# EAGLE design Decoder (EAGLE 9.6.2)

## Sheet 1 of 5
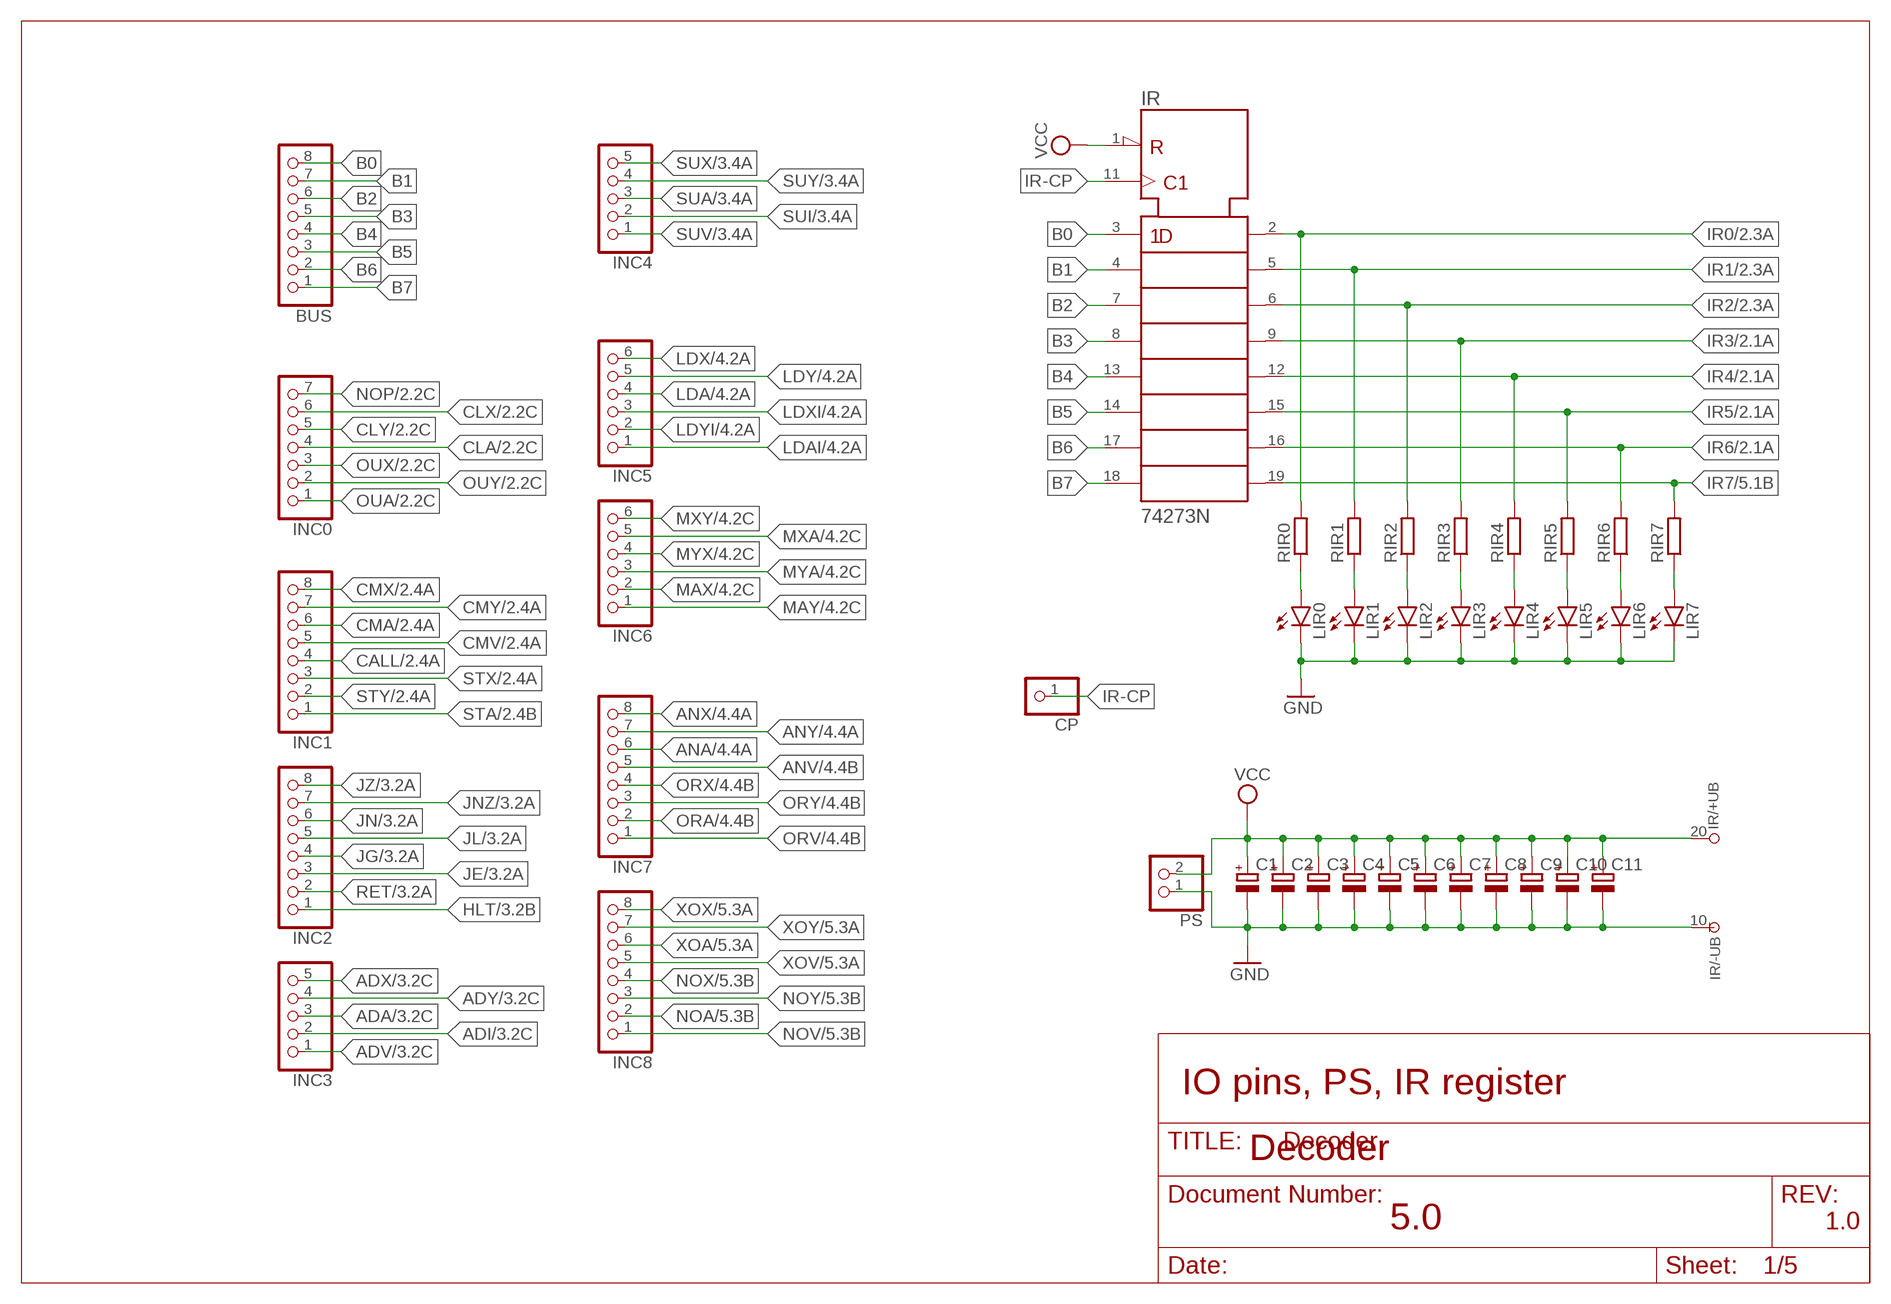
[diagram p0: schematic, sheet 1]

### Parts
BUS  PINHD-1X8  [1X08]
C1  CPOL-EUE2.5-6  [E2,5-6]
C2  CPOL-EUE2.5-6  [E2,5-6]
C3  CPOL-EUE2.5-6  [E2,5-6]
C4  CPOL-EUE2.5-6  [E2,5-6]
C5  CPOL-EUE2.5-6  [E2,5-6]
C6  CPOL-EUE2.5-6  [E2,5-6]
C7  CPOL-EUE2.5-6  [E2,5-6]
C8  CPOL-EUE2.5-6  [E2,5-6]
C9  CPOL-EUE2.5-6  [E2,5-6]
C10  CPOL-EUE2.5-6  [E2,5-6]
C11  CPOL-EUE2.5-6  [E2,5-6]
CP  PINHD-1X1  [1X01]
INC0  PINHD-1X7  [1X07]
INC1  PINHD-1X8  [1X08]
INC2  PINHD-1X8  [1X08]
INC3  PINHD-1X5  [1X05]
INC4  PINHD-1X5  [1X05]
INC5  PINHD-1X6  [1X06]
INC6  PINHD-1X6  [1X06]
INC7  PINHD-1X8  [1X08]
INC8  PINHD-1X8  [1X08]
IR  74273N  [DIL20]
LIR0  LED5MM  [LED5MM]
LIR1  LED5MM  [LED5MM]
LIR2  LED5MM  [LED5MM]
LIR3  LED5MM  [LED5MM]
LIR4  LED5MM  [LED5MM]
LIR5  LED5MM  [LED5MM]
LIR6  LED5MM  [LED5MM]
LIR7  LED5MM  [LED5MM]
PS  PINHD-1X2  [1X02]
RIR0  R-EU_0204/7  [0204/7]
RIR1  R-EU_0204/7  [0204/7]
RIR2  R-EU_0204/7  [0204/7]
RIR3  R-EU_0204/7  [0204/7]
RIR4  R-EU_0204/7  [0204/7]
RIR5  R-EU_0204/7  [0204/7]
RIR6  R-EU_0204/7  [0204/7]
RIR7  R-EU_0204/7  [0204/7]

### Nets
ADA: INC3.3 ; also sheet 3
ADI: INC3.2 ; also sheet 3
ADV: INC3.1 ; also sheet 3
ADX: INC3.5 ; also sheet 3
ADY: INC3.4 ; also sheet 3
ANA: INC7.6 ; also sheet 4
ANV: INC7.5 ; also sheet 4
ANX: INC7.8 ; also sheet 4
ANY: INC7.7 ; also sheet 4
B0: BUS.8 IR.3(1D)
B1: BUS.7 IR.4(2D)
B2: BUS.6 IR.7(3D)
B3: BUS.5 IR.8(4D)
B4: BUS.4 IR.13(5D)
B5: BUS.3 IR.14(6D)
B6: BUS.2 IR.17(7D)
B7: BUS.1 IR.18(8D)
CALL: INC1.4 ; also sheet 2
CLA: INC0.4 ; also sheet 2
CLX: INC0.6 ; also sheet 2
CLY: INC0.5 ; also sheet 2
CMA: INC1.6 ; also sheet 2
CMV: INC1.5 ; also sheet 2
CMX: INC1.8 ; also sheet 2
CMY: INC1.7 ; also sheet 2
GND: C1.- C2.- C3.- C4.- C5.- C6.- C7.- C8.- C9.- C10.- C11.- IR.10(-UB) LIR0.K(C) LIR1.K(C) LIR2.K(C) LIR3.K(C) LIR4.K(C) LIR5.K(C) LIR6.K(C) LIR7.K(C) PS.1 ; also sheet 2,3,4,5
HLT: INC2.1 ; also sheet 3
IR0: IR.2(1Q) RIR0.2 ; also sheet 2,3,4,5
IR1: IR.5(2Q) RIR1.2 ; also sheet 2,3,4,5
IR2: IR.6(3Q) RIR2.2 ; also sheet 2,3,4,5
IR3: IR.9(4Q) RIR3.2 ; also sheet 2
IR4: IR.12(5Q) RIR4.2 ; also sheet 2
IR5: IR.15(6Q) RIR5.2 ; also sheet 2
IR6: IR.16(7Q) RIR6.2 ; also sheet 2
IR7: IR.19(8Q) RIR7.2 ; also sheet 5
IR-CP: CP.1 IR.11(CLK)
JE: INC2.3 ; also sheet 3
JG: INC2.4 ; also sheet 3
JL: INC2.5 ; also sheet 3
JN: INC2.6 ; also sheet 3
JNZ: INC2.7 ; also sheet 3
JZ: INC2.8 ; also sheet 3
LDA: INC5.4 ; also sheet 4
LDAI: INC5.1 ; also sheet 4
LDX: INC5.6 ; also sheet 4
LDXI: INC5.3 ; also sheet 4
LDY: INC5.5 ; also sheet 4
LDYI: INC5.2 ; also sheet 4
MAX: INC6.2 ; also sheet 4
MAY: INC6.1 ; also sheet 4
MXA: INC6.5 ; also sheet 4
MXY: INC6.6 ; also sheet 4
MYA: INC6.3 ; also sheet 4
MYX: INC6.4 ; also sheet 4
N$10: LIR0.A RIR0.1
N$11: LIR1.A RIR1.1
N$12: LIR2.A RIR2.1
N$13: LIR3.A RIR3.1
N$14: LIR4.A RIR4.1
N$15: LIR5.A RIR5.1
N$16: LIR6.A RIR6.1
N$17: LIR7.A RIR7.1
NOA: INC8.2 ; also sheet 5
NOP: INC0.7 ; also sheet 2
NOV: INC8.1 ; also sheet 5
NOX: INC8.4 ; also sheet 5
NOY: INC8.3 ; also sheet 5
ORA: INC7.2 ; also sheet 4
ORV: INC7.1 ; also sheet 4
ORX: INC7.4 ; also sheet 4
ORY: INC7.3 ; also sheet 4
OUA: INC0.1 ; also sheet 2
OUX: INC0.3 ; also sheet 2
OUY: INC0.2 ; also sheet 2
RET: INC2.2 ; also sheet 3
STA: INC1.1 ; also sheet 2
STX: INC1.3 ; also sheet 2
STY: INC1.2 ; also sheet 2
SUA: INC4.3 ; also sheet 3
SUI: INC4.2 ; also sheet 3
SUV: INC4.1 ; also sheet 3
SUX: INC4.5 ; also sheet 3
SUY: INC4.4 ; also sheet 3
VCC: C1.+ C2.+ C3.+ C4.+ C5.+ C6.+ C7.+ C8.+ C9.+ C10.+ C11.+ IR.1(!CLR) IR.20(+UB) PS.2 ; also sheet 2,3,4,5
XOA: INC8.6 ; also sheet 5
XOV: INC8.5 ; also sheet 5
XOX: INC8.8 ; also sheet 5
XOY: INC8.7 ; also sheet 5

### Notes on the sheet
- IO pins, PS, IR register
- Decoder
- 5.0 | 1.0

## Sheet 2 of 5
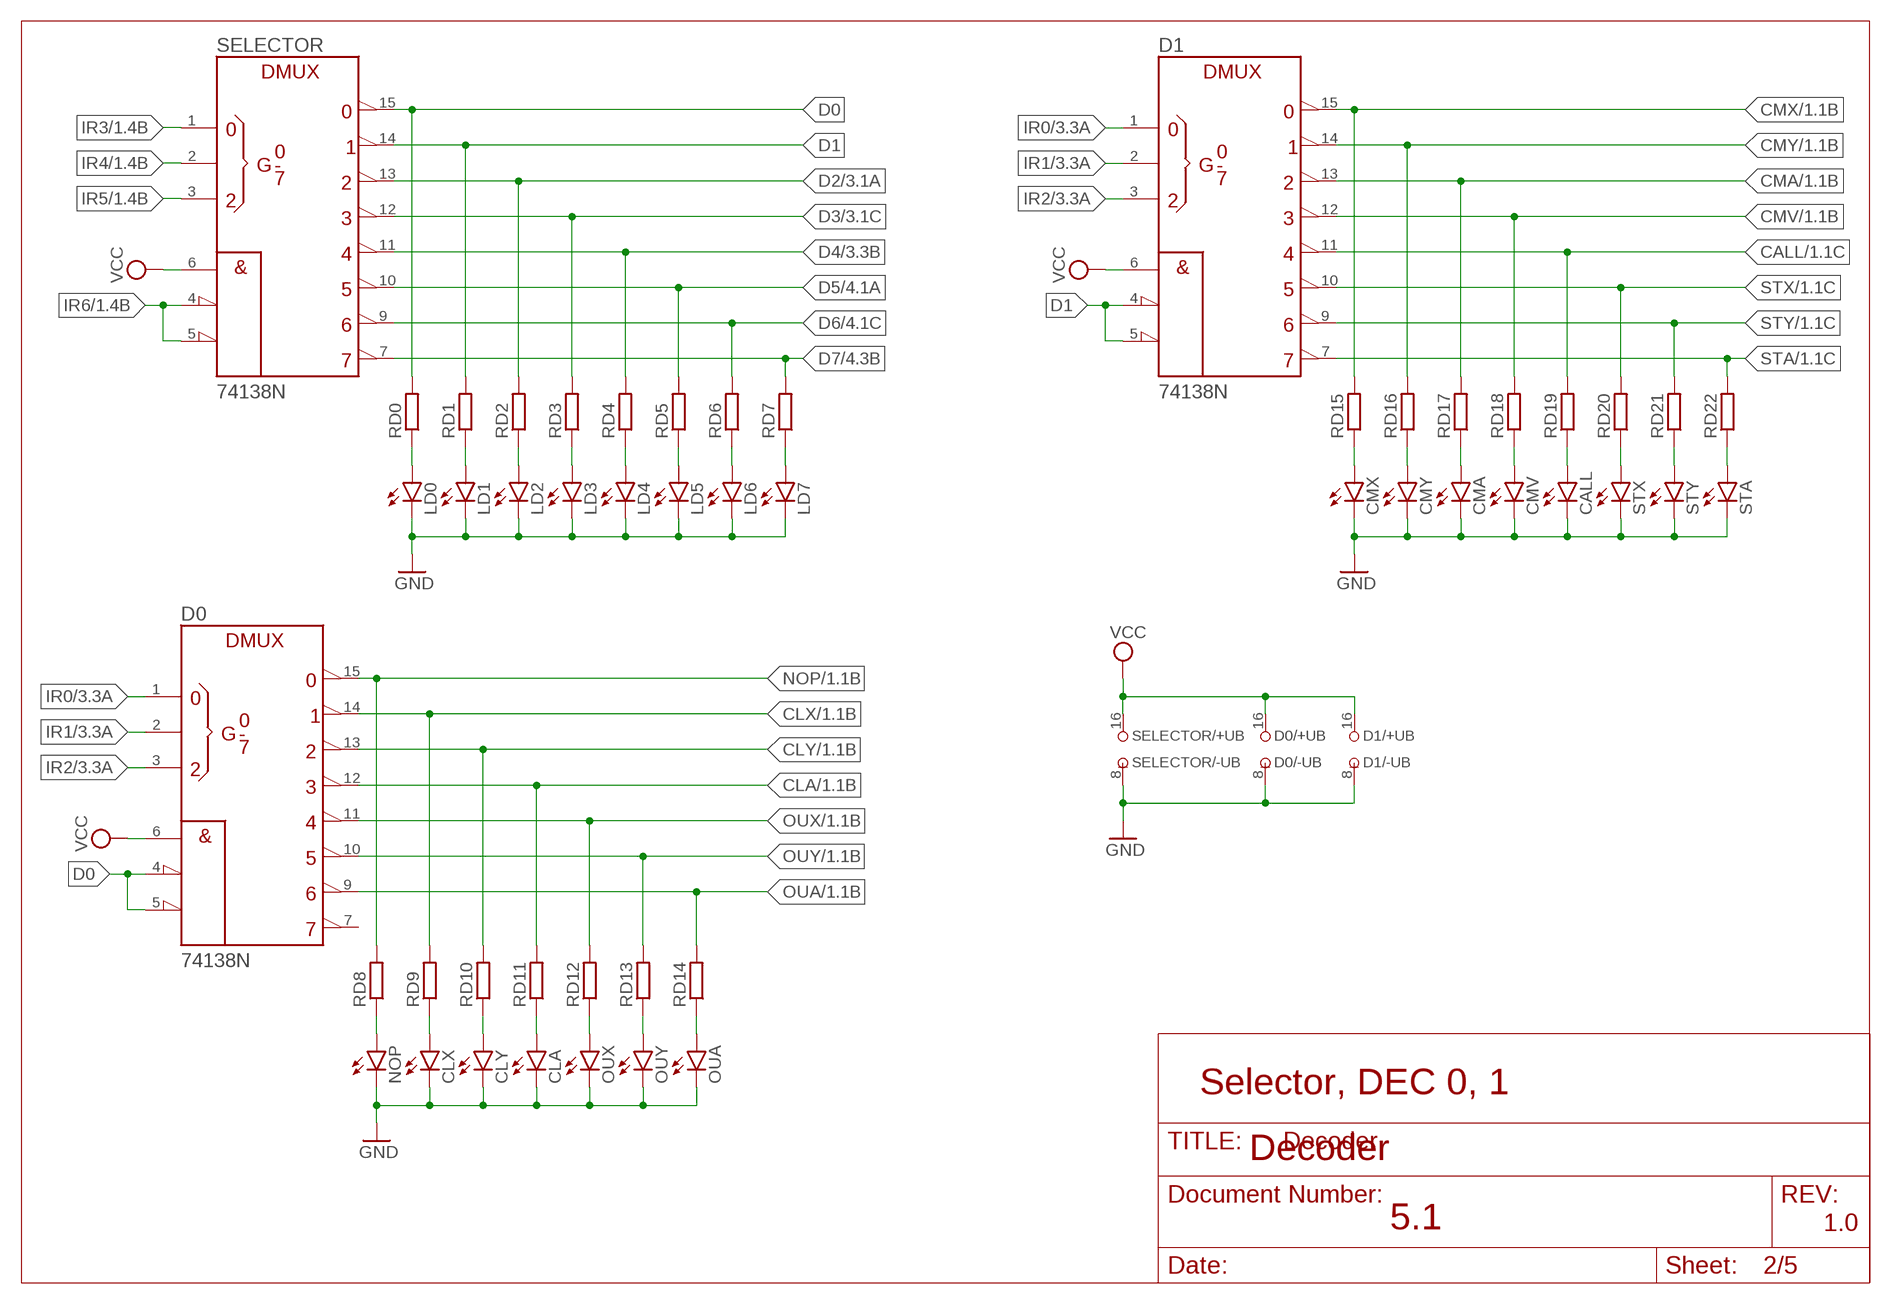
[diagram p1: schematic, sheet 2]

### Parts
CALL  LED5MM  [LED5MM]
CLA  LED5MM  [LED5MM]
CLX  LED5MM  [LED5MM]
CLY  LED5MM  [LED5MM]
CMA  LED5MM  [LED5MM]
CMV  LED5MM  [LED5MM]
CMX  LED5MM  [LED5MM]
CMY  LED5MM  [LED5MM]
D0  74138N  [DIL16]
D1  74138N  [DIL16]
LD0  LED5MM  [LED5MM]
LD1  LED5MM  [LED5MM]
LD2  LED5MM  [LED5MM]
LD3  LED5MM  [LED5MM]
LD4  LED5MM  [LED5MM]
LD5  LED5MM  [LED5MM]
LD6  LED5MM  [LED5MM]
LD7  LED5MM  [LED5MM]
NOP  LED5MM  [LED5MM]
OUA  LED5MM  [LED5MM]
OUX  LED5MM  [LED5MM]
OUY  LED5MM  [LED5MM]
RD0  R-EU_0204/7  [0204/7]
RD1  R-EU_0204/7  [0204/7]
RD2  R-EU_0204/7  [0204/7]
RD3  R-EU_0204/7  [0204/7]
RD4  R-EU_0204/7  [0204/7]
RD5  R-EU_0204/7  [0204/7]
RD6  R-EU_0204/7  [0204/7]
RD7  R-EU_0204/7  [0204/7]
RD8  R-EU_0204/7  [0204/7]
RD9  R-EU_0204/7  [0204/7]
RD10  R-EU_0204/7  [0204/7]
RD11  R-EU_0204/7  [0204/7]
RD12  R-EU_0204/7  [0204/7]
RD13  R-EU_0204/7  [0204/7]
RD14  R-EU_0204/7  [0204/7]
RD15  R-EU_0204/7  [0204/7]
RD16  R-EU_0204/7  [0204/7]
RD17  R-EU_0204/7  [0204/7]
RD18  R-EU_0204/7  [0204/7]
RD19  R-EU_0204/7  [0204/7]
RD20  R-EU_0204/7  [0204/7]
RD21  R-EU_0204/7  [0204/7]
RD22  R-EU_0204/7  [0204/7]
SELECTOR  74138N  [DIL16]
STA  LED5MM  [LED5MM]
STX  LED5MM  [LED5MM]
STY  LED5MM  [LED5MM]

### Nets
CALL: D1.11(Y4) RD19.2 ; also sheet 1
CLA: D0.12(Y3) RD11.2 ; also sheet 1
CLX: D0.14(Y1) RD9.2 ; also sheet 1
CLY: D0.13(Y2) RD10.2 ; also sheet 1
CMA: D1.13(Y2) RD17.2 ; also sheet 1
CMV: D1.12(Y3) RD18.2 ; also sheet 1
CMX: D1.15(Y0) RD15.2 ; also sheet 1
CMY: D1.14(Y1) RD16.2 ; also sheet 1
D0: D0.4(!G2A) D0.5(!G2B) RD0.2 SELECTOR.15(Y0)
D1: D1.4(!G2A) D1.5(!G2B) RD1.2 SELECTOR.14(Y1)
D2: RD2.2 SELECTOR.13(Y2) ; also sheet 3
D3: RD3.2 SELECTOR.12(Y3) ; also sheet 3
D4: RD4.2 SELECTOR.11(Y4) ; also sheet 3
D5: RD5.2 SELECTOR.10(Y5) ; also sheet 4
D6: RD6.2 SELECTOR.9(Y6) ; also sheet 4
D7: RD7.2 SELECTOR.7(Y7) ; also sheet 4
GND: CALL.K(C) CLA.K(C) CLX.K(C) CLY.K(C) CMA.K(C) CMV.K(C) CMX.K(C) CMY.K(C) D0.8(-UB) D1.8(-UB) LD0.K(C) LD1.K(C) LD2.K(C) LD3.K(C) LD4.K(C) LD5.K(C) LD6.K(C) LD7.K(C) NOP.K(C) OUA.K(C) OUX.K(C) OUY.K(C) SELECTOR.8(-UB) STA.K(C) STX.K(C) STY.K(C) ; also sheet 1,3,4,5
IR0: D0.1(A) D1.1(A) ; also sheet 1,3,4,5
IR1: D0.2(B) D1.2(B) ; also sheet 1,3,4,5
IR2: D0.3(C) D1.3(C) ; also sheet 1,3,4,5
IR3: SELECTOR.1(A) ; also sheet 1
IR4: SELECTOR.2(B) ; also sheet 1
IR5: SELECTOR.3(C) ; also sheet 1
IR6: SELECTOR.4(!G2A) SELECTOR.5(!G2B) ; also sheet 1
N$1: LD0.A RD0.1
N$2: LD1.A RD1.1
N$3: LD2.A RD2.1
N$4: LD3.A RD3.1
N$5: LD4.A RD4.1
N$6: LD5.A RD5.1
N$7: LD6.A RD6.1
N$8: LD7.A RD7.1
N$9: CMX.A RD15.1
N$18: CMY.A RD16.1
N$19: CMA.A RD17.1
N$20: CMV.A RD18.1
N$21: CALL.A RD19.1
N$22: RD20.1 STX.A
N$23: RD21.1 STY.A
N$24: RD22.1 STA.A
N$25: NOP.A RD8.1
N$26: CLX.A RD9.1
N$27: CLY.A RD10.1
N$28: CLA.A RD11.1
N$29: OUX.A RD12.1
N$30: OUY.A RD13.1
N$31: OUA.A RD14.1
NOP: D0.15(Y0) RD8.2 ; also sheet 1
OUA: D0.9(Y6) RD14.2 ; also sheet 1
OUX: D0.11(Y4) RD12.2 ; also sheet 1
OUY: D0.10(Y5) RD13.2 ; also sheet 1
STA: D1.7(Y7) RD22.2 ; also sheet 1
STX: D1.10(Y5) RD20.2 ; also sheet 1
STY: D1.9(Y6) RD21.2 ; also sheet 1
VCC: D0.6(G1) D0.16(+UB) D1.6(G1) D1.16(+UB) SELECTOR.6(G1) SELECTOR.16(+UB) ; also sheet 1,3,4,5
Unconnected: D0.7(Y7)

### Notes on the sheet
- Selector, DEC 0, 1
- Decoder
- 5.1 | 1.0

## Sheet 3 of 5
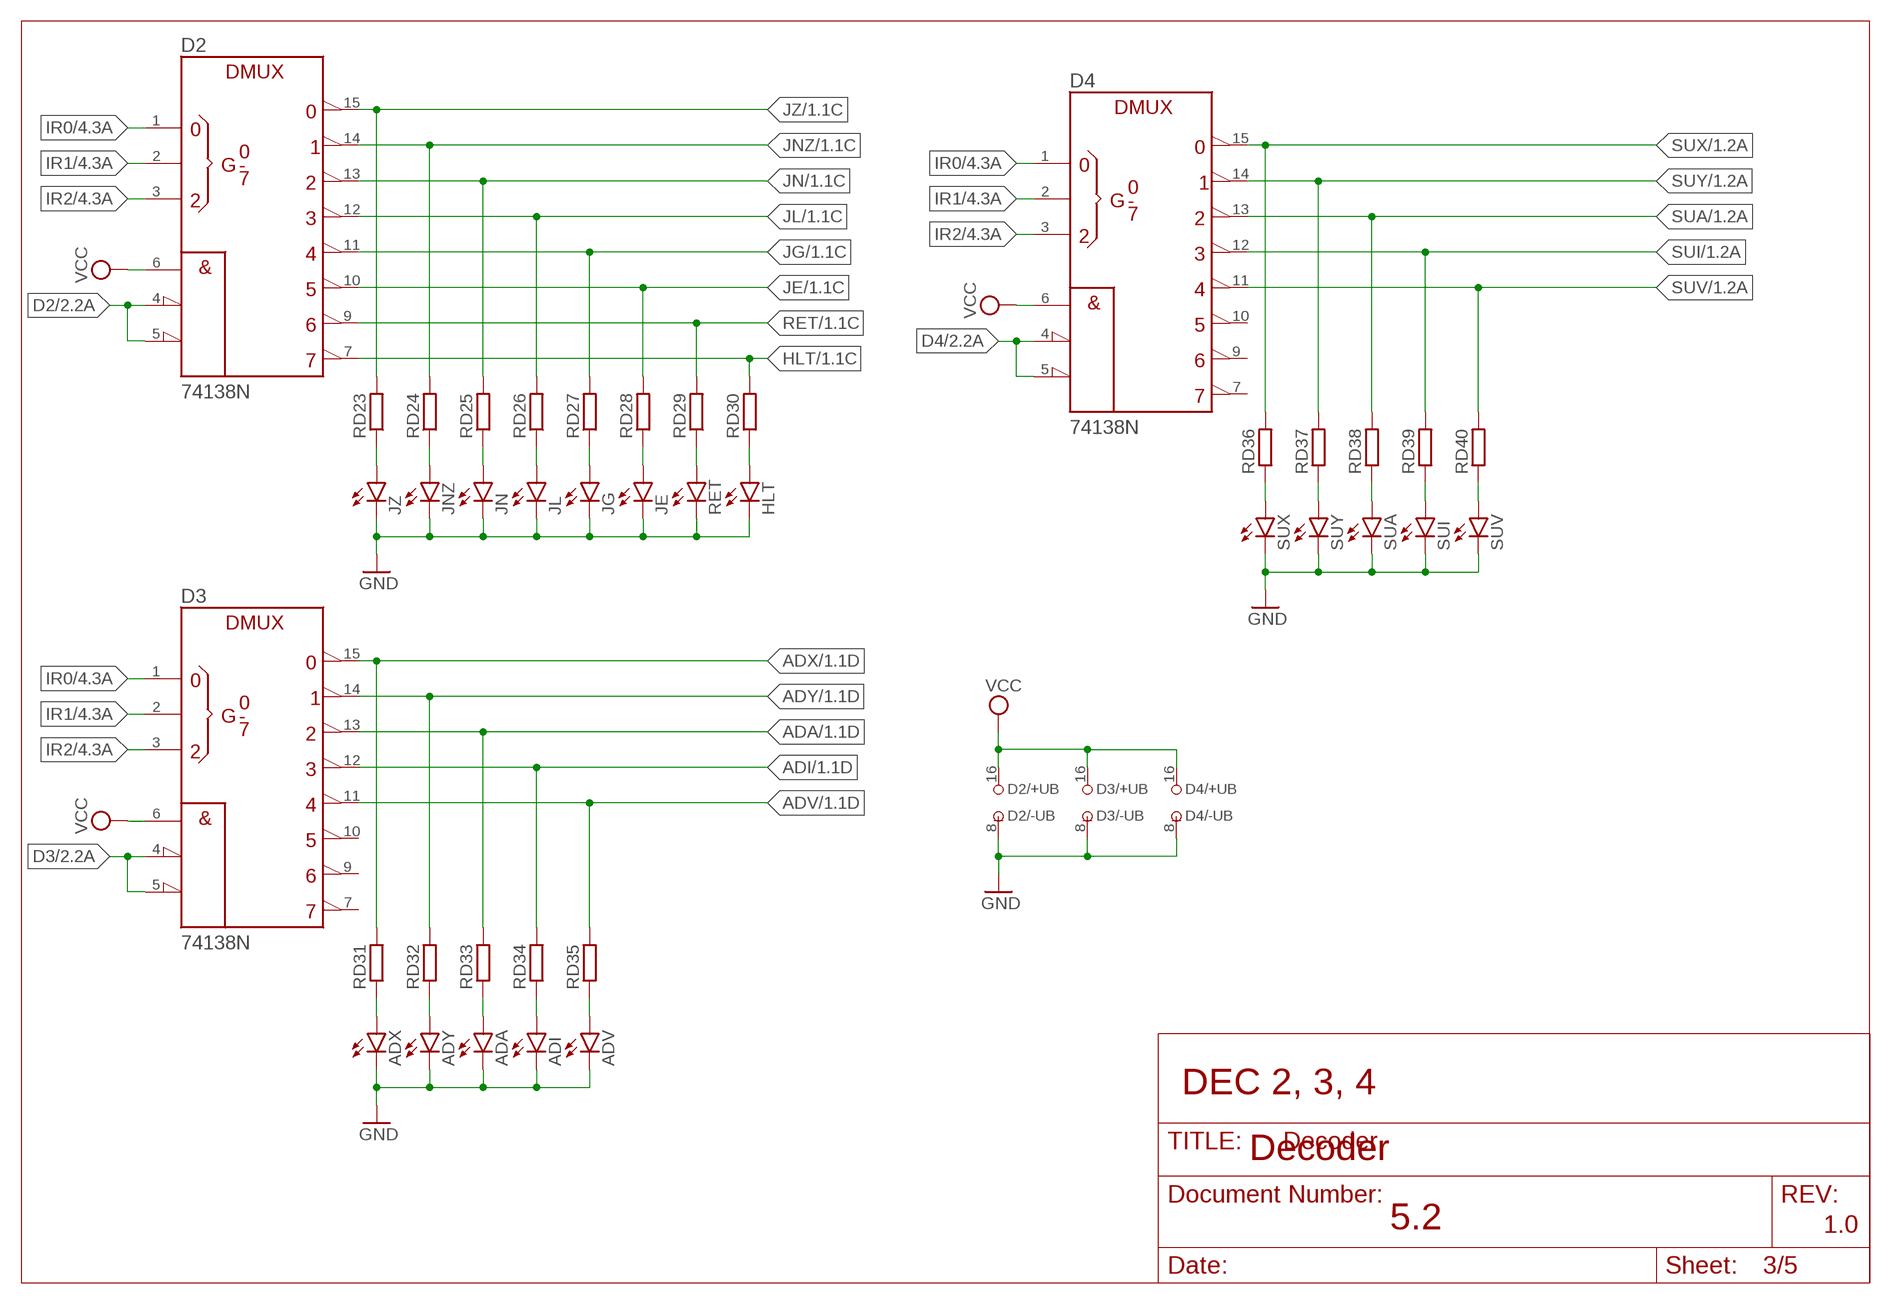
[diagram p2: schematic, sheet 3]

### Parts
ADA  LED5MM  [LED5MM]
ADI  LED5MM  [LED5MM]
ADV  LED5MM  [LED5MM]
ADX  LED5MM  [LED5MM]
ADY  LED5MM  [LED5MM]
D2  74138N  [DIL16]
D3  74138N  [DIL16]
D4  74138N  [DIL16]
HLT  LED5MM  [LED5MM]
JE  LED5MM  [LED5MM]
JG  LED5MM  [LED5MM]
JL  LED5MM  [LED5MM]
JN  LED5MM  [LED5MM]
JNZ  LED5MM  [LED5MM]
JZ  LED5MM  [LED5MM]
RD23  R-EU_0204/7  [0204/7]
RD24  R-EU_0204/7  [0204/7]
RD25  R-EU_0204/7  [0204/7]
RD26  R-EU_0204/7  [0204/7]
RD27  R-EU_0204/7  [0204/7]
RD28  R-EU_0204/7  [0204/7]
RD29  R-EU_0204/7  [0204/7]
RD30  R-EU_0204/7  [0204/7]
RD31  R-EU_0204/7  [0204/7]
RD32  R-EU_0204/7  [0204/7]
RD33  R-EU_0204/7  [0204/7]
RD34  R-EU_0204/7  [0204/7]
RD35  R-EU_0204/7  [0204/7]
RD36  R-EU_0204/7  [0204/7]
RD37  R-EU_0204/7  [0204/7]
RD38  R-EU_0204/7  [0204/7]
RD39  R-EU_0204/7  [0204/7]
RD40  R-EU_0204/7  [0204/7]
RET  LED5MM  [LED5MM]
SUA  LED5MM  [LED5MM]
SUI  LED5MM  [LED5MM]
SUV  LED5MM  [LED5MM]
SUX  LED5MM  [LED5MM]
SUY  LED5MM  [LED5MM]

### Nets
ADA: D3.13(Y2) RD33.2 ; also sheet 1
ADI: D3.12(Y3) RD34.2 ; also sheet 1
ADV: D3.11(Y4) RD35.2 ; also sheet 1
ADX: D3.15(Y0) RD31.2 ; also sheet 1
ADY: D3.14(Y1) RD32.2 ; also sheet 1
D2: D2.4(!G2A) D2.5(!G2B) ; also sheet 2
D3: D3.4(!G2A) D3.5(!G2B) ; also sheet 2
D4: D4.4(!G2A) D4.5(!G2B) ; also sheet 2
GND: ADA.K(C) ADI.K(C) ADV.K(C) ADX.K(C) ADY.K(C) D2.8(-UB) D3.8(-UB) D4.8(-UB) HLT.K(C) JE.K(C) JG.K(C) JL.K(C) JN.K(C) JNZ.K(C) JZ.K(C) RET.K(C) SUA.K(C) SUI.K(C) SUV.K(C) SUX.K(C) SUY.K(C) ; also sheet 1,2,4,5
HLT: D2.7(Y7) RD30.2 ; also sheet 1
IR0: D2.1(A) D3.1(A) D4.1(A) ; also sheet 1,2,4,5
IR1: D2.2(B) D3.2(B) D4.2(B) ; also sheet 1,2,4,5
IR2: D2.3(C) D3.3(C) D4.3(C) ; also sheet 1,2,4,5
JE: D2.10(Y5) RD28.2 ; also sheet 1
JG: D2.11(Y4) RD27.2 ; also sheet 1
JL: D2.12(Y3) RD26.2 ; also sheet 1
JN: D2.13(Y2) RD25.2 ; also sheet 1
JNZ: D2.14(Y1) RD24.2 ; also sheet 1
JZ: D2.15(Y0) RD23.2 ; also sheet 1
N$32: JZ.A RD23.1
N$33: JNZ.A RD24.1
N$34: JN.A RD25.1
N$35: JL.A RD26.1
N$36: JG.A RD27.1
N$37: JE.A RD28.1
N$38: RD29.1 RET.A
N$39: HLT.A RD30.1
N$40: ADX.A RD31.1
N$41: ADY.A RD32.1
N$42: ADA.A RD33.1
N$43: ADI.A RD34.1
N$44: ADV.A RD35.1
N$45: RD36.1 SUX.A
N$46: RD37.1 SUY.A
N$47: RD38.1 SUA.A
N$48: RD39.1 SUI.A
N$49: RD40.1 SUV.A
RET: D2.9(Y6) RD29.2 ; also sheet 1
SUA: D4.13(Y2) RD38.2 ; also sheet 1
SUI: D4.12(Y3) RD39.2 ; also sheet 1
SUV: D4.11(Y4) RD40.2 ; also sheet 1
SUX: D4.15(Y0) RD36.2 ; also sheet 1
SUY: D4.14(Y1) RD37.2 ; also sheet 1
VCC: D2.6(G1) D2.16(+UB) D3.6(G1) D3.16(+UB) D4.6(G1) D4.16(+UB) ; also sheet 1,2,4,5
Unconnected: D3.7(Y7) D3.9(Y6) D3.10(Y5) D4.7(Y7) D4.9(Y6) D4.10(Y5)

### Notes on the sheet
- DEC 2, 3, 4
- Decoder
- 5.2 | 1.0

## Sheet 4 of 5
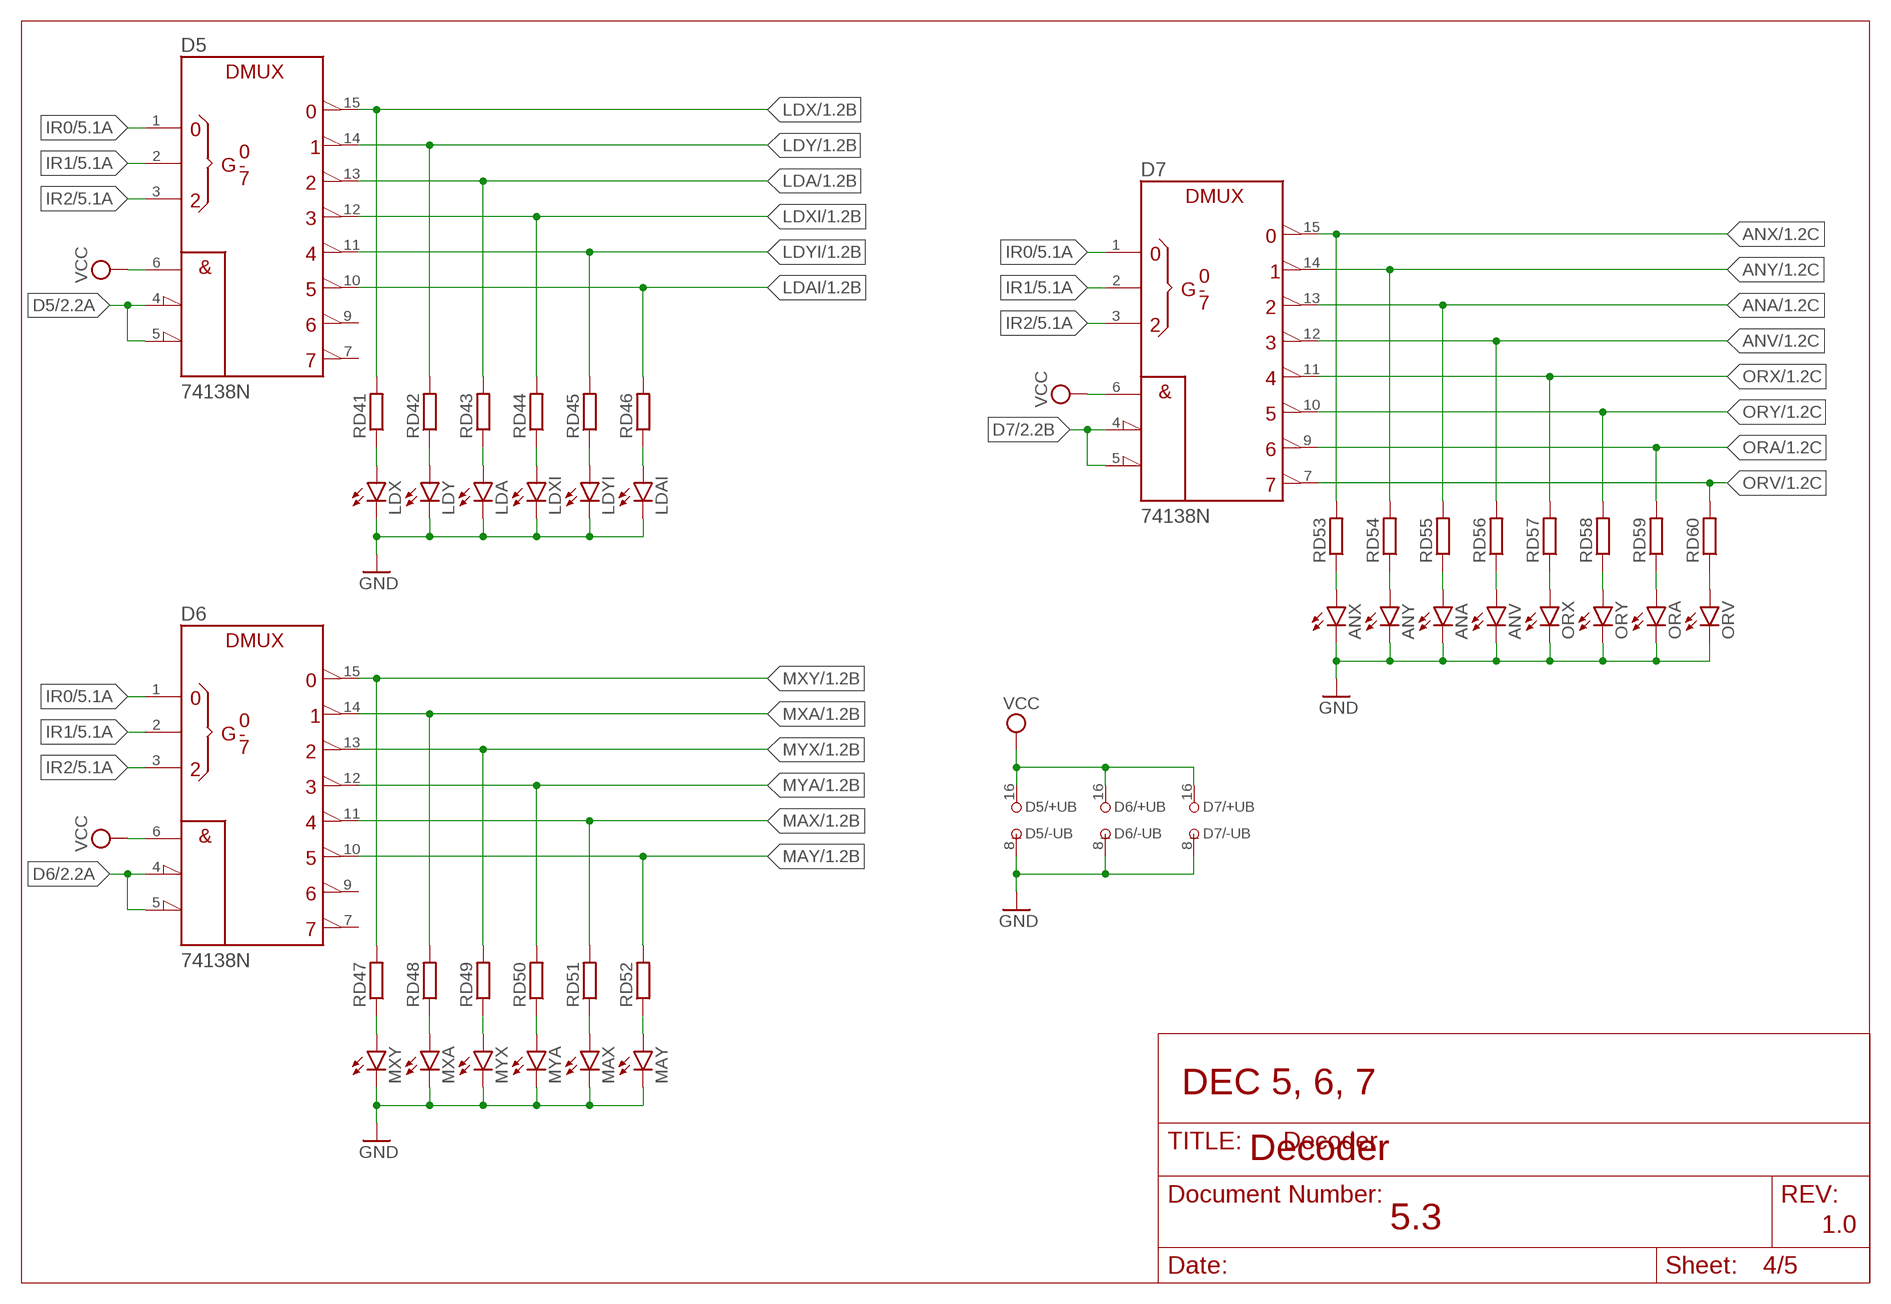
[diagram p3: schematic, sheet 4]

### Parts
ANA  LED5MM  [LED5MM]
ANV  LED5MM  [LED5MM]
ANX  LED5MM  [LED5MM]
ANY  LED5MM  [LED5MM]
D5  74138N  [DIL16]
D6  74138N  [DIL16]
D7  74138N  [DIL16]
LDA  LED5MM  [LED5MM]
LDAI  LED5MM  [LED5MM]
LDX  LED5MM  [LED5MM]
LDXI  LED5MM  [LED5MM]
LDY  LED5MM  [LED5MM]
LDYI  LED5MM  [LED5MM]
MAX  LED5MM  [LED5MM]
MAY  LED5MM  [LED5MM]
MXA  LED5MM  [LED5MM]
MXY  LED5MM  [LED5MM]
MYA  LED5MM  [LED5MM]
MYX  LED5MM  [LED5MM]
ORA  LED5MM  [LED5MM]
ORV  LED5MM  [LED5MM]
ORX  LED5MM  [LED5MM]
ORY  LED5MM  [LED5MM]
RD41  R-EU_0204/7  [0204/7]
RD42  R-EU_0204/7  [0204/7]
RD43  R-EU_0204/7  [0204/7]
RD44  R-EU_0204/7  [0204/7]
RD45  R-EU_0204/7  [0204/7]
RD46  R-EU_0204/7  [0204/7]
RD47  R-EU_0204/7  [0204/7]
RD48  R-EU_0204/7  [0204/7]
RD49  R-EU_0204/7  [0204/7]
RD50  R-EU_0204/7  [0204/7]
RD51  R-EU_0204/7  [0204/7]
RD52  R-EU_0204/7  [0204/7]
RD53  R-EU_0204/7  [0204/7]
RD54  R-EU_0204/7  [0204/7]
RD55  R-EU_0204/7  [0204/7]
RD56  R-EU_0204/7  [0204/7]
RD57  R-EU_0204/7  [0204/7]
RD58  R-EU_0204/7  [0204/7]
RD59  R-EU_0204/7  [0204/7]
RD60  R-EU_0204/7  [0204/7]

### Nets
ANA: D7.13(Y2) RD55.2 ; also sheet 1
ANV: D7.12(Y3) RD56.2 ; also sheet 1
ANX: D7.15(Y0) RD53.2 ; also sheet 1
ANY: D7.14(Y1) RD54.2 ; also sheet 1
D5: D5.4(!G2A) D5.5(!G2B) ; also sheet 2
D6: D6.4(!G2A) D6.5(!G2B) ; also sheet 2
D7: D7.4(!G2A) D7.5(!G2B) ; also sheet 2
GND: ANA.K(C) ANV.K(C) ANX.K(C) ANY.K(C) D5.8(-UB) D6.8(-UB) D7.8(-UB) LDA.K(C) LDAI.K(C) LDX.K(C) LDXI.K(C) LDY.K(C) LDYI.K(C) MAX.K(C) MAY.K(C) MXA.K(C) MXY.K(C) MYA.K(C) MYX.K(C) ORA.K(C) ORV.K(C) ORX.K(C) ORY.K(C) ; also sheet 1,2,3,5
IR0: D5.1(A) D6.1(A) D7.1(A) ; also sheet 1,2,3,5
IR1: D5.2(B) D6.2(B) D7.2(B) ; also sheet 1,2,3,5
IR2: D5.3(C) D6.3(C) D7.3(C) ; also sheet 1,2,3,5
LDA: D5.13(Y2) RD43.2 ; also sheet 1
LDAI: D5.10(Y5) RD46.2 ; also sheet 1
LDX: D5.15(Y0) RD41.2 ; also sheet 1
LDXI: D5.12(Y3) RD44.2 ; also sheet 1
LDY: D5.14(Y1) RD42.2 ; also sheet 1
LDYI: D5.11(Y4) RD45.2 ; also sheet 1
MAX: D6.11(Y4) RD51.2 ; also sheet 1
MAY: D6.10(Y5) RD52.2 ; also sheet 1
MXA: D6.14(Y1) RD48.2 ; also sheet 1
MXY: D6.15(Y0) RD47.2 ; also sheet 1
MYA: D6.12(Y3) RD50.2 ; also sheet 1
MYX: D6.13(Y2) RD49.2 ; also sheet 1
N$50: LDX.A RD41.1
N$51: LDY.A RD42.1
N$52: LDA.A RD43.1
N$53: LDXI.A RD44.1
N$54: LDYI.A RD45.1
N$55: LDAI.A RD46.1
N$56: MXY.A RD47.1
N$57: MXA.A RD48.1
N$58: MYX.A RD49.1
N$59: MYA.A RD50.1
N$60: MAX.A RD51.1
N$61: MAY.A RD52.1
N$62: ANX.A RD53.1
N$63: ANY.A RD54.1
N$64: ANA.A RD55.1
N$65: ANV.A RD56.1
N$66: ORX.A RD57.1
N$67: ORY.A RD58.1
N$68: ORA.A RD59.1
N$69: ORV.A RD60.1
ORA: D7.9(Y6) RD59.2 ; also sheet 1
ORV: D7.7(Y7) RD60.2 ; also sheet 1
ORX: D7.11(Y4) RD57.2 ; also sheet 1
ORY: D7.10(Y5) RD58.2 ; also sheet 1
VCC: D5.6(G1) D5.16(+UB) D6.6(G1) D6.16(+UB) D7.6(G1) D7.16(+UB) ; also sheet 1,2,3,5
Unconnected: D5.7(Y7) D5.9(Y6) D6.7(Y7) D6.9(Y6)

### Notes on the sheet
- DEC 5, 6, 7
- Decoder
- 5.3 | 1.0

## Sheet 5 of 5
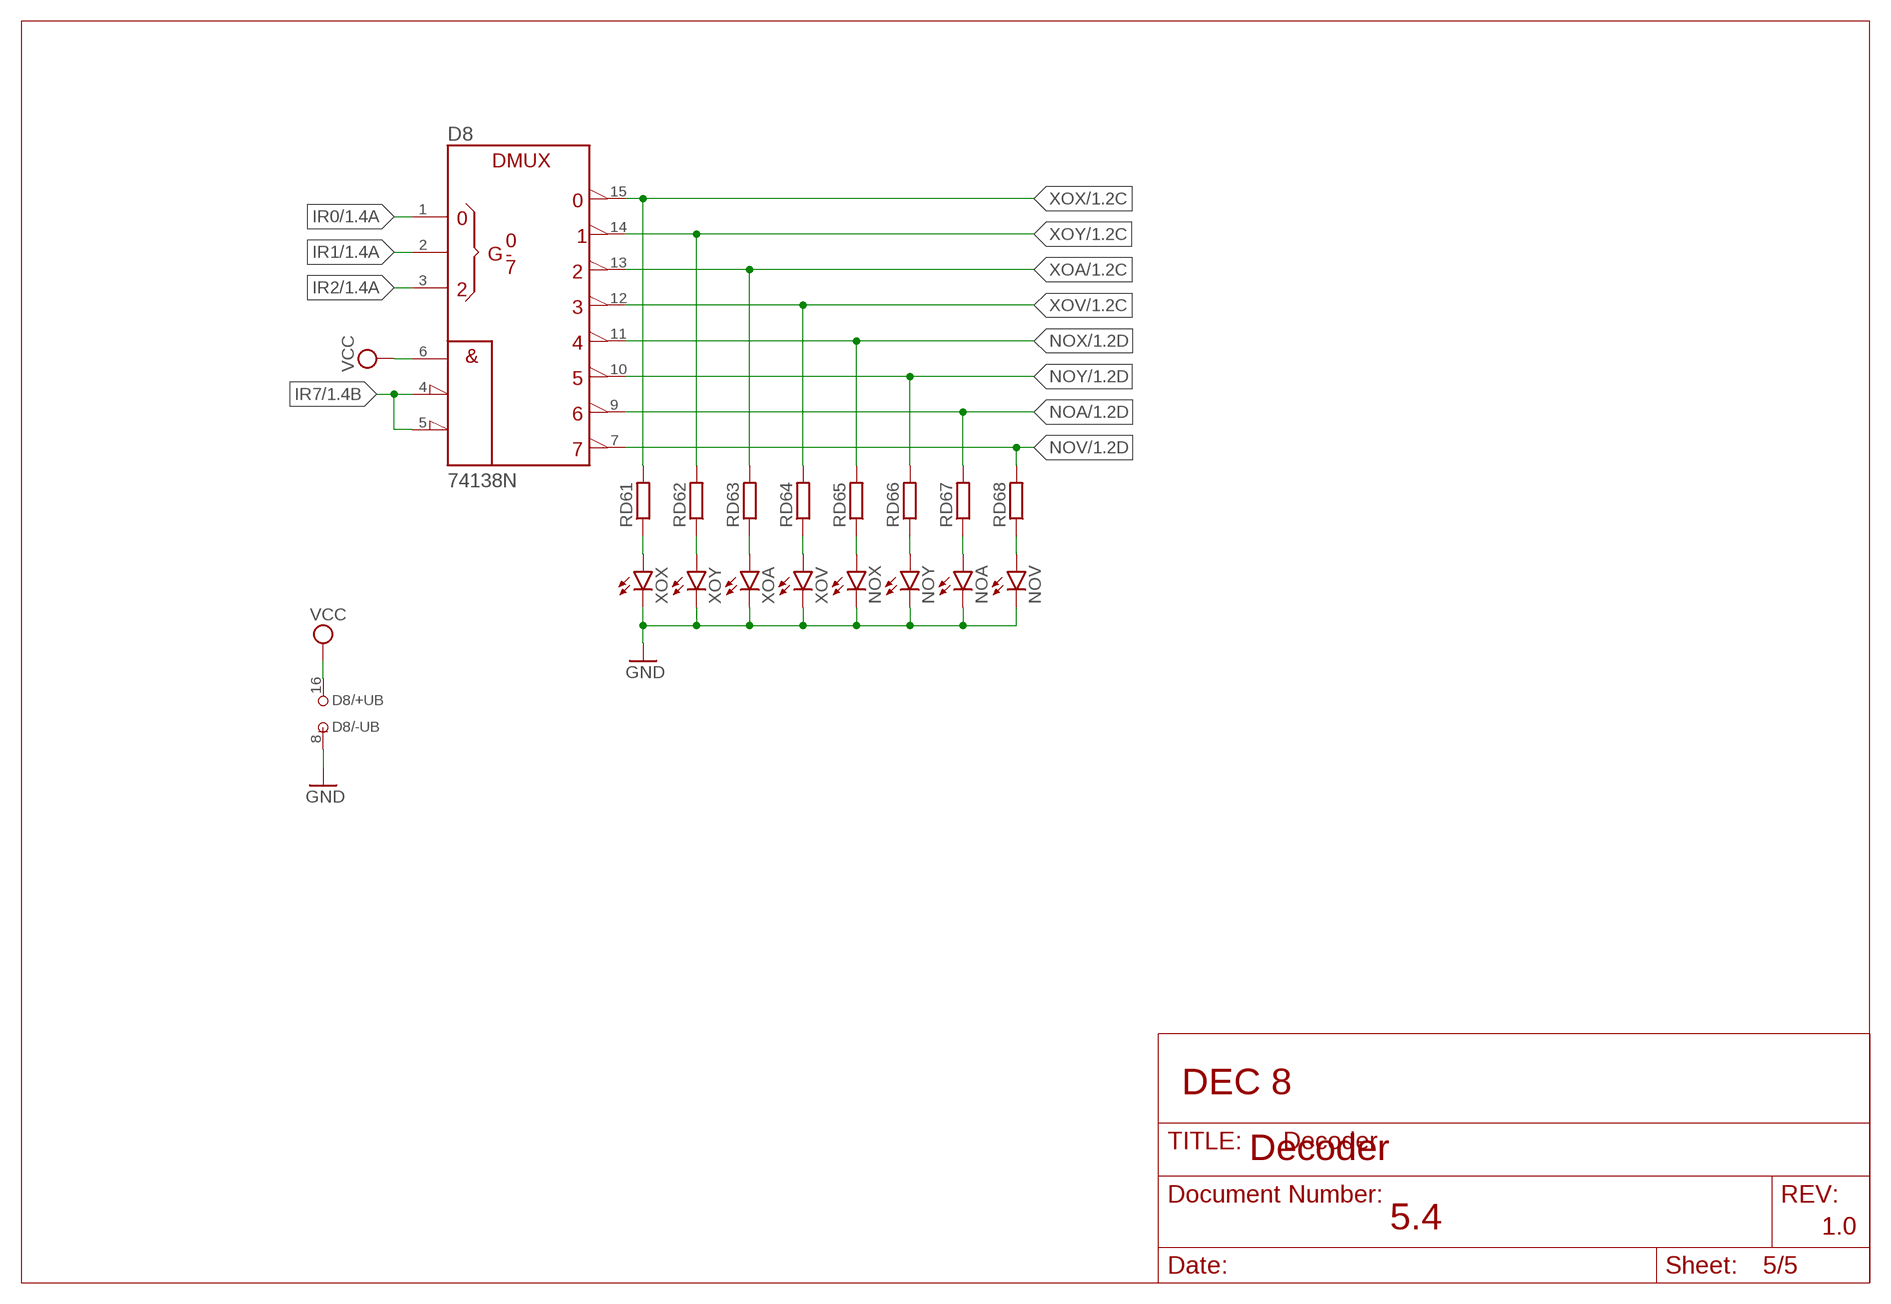
[diagram p4: schematic, sheet 5]

### Parts
D8  74138N  [DIL16]
NOA  LED5MM  [LED5MM]
NOV  LED5MM  [LED5MM]
NOX  LED5MM  [LED5MM]
NOY  LED5MM  [LED5MM]
RD61  R-EU_0204/7  [0204/7]
RD62  R-EU_0204/7  [0204/7]
RD63  R-EU_0204/7  [0204/7]
RD64  R-EU_0204/7  [0204/7]
RD65  R-EU_0204/7  [0204/7]
RD66  R-EU_0204/7  [0204/7]
RD67  R-EU_0204/7  [0204/7]
RD68  R-EU_0204/7  [0204/7]
XOA  LED5MM  [LED5MM]
XOV  LED5MM  [LED5MM]
XOX  LED5MM  [LED5MM]
XOY  LED5MM  [LED5MM]

### Nets
GND: D8.8(-UB) NOA.K(C) NOV.K(C) NOX.K(C) NOY.K(C) XOA.K(C) XOV.K(C) XOX.K(C) XOY.K(C) ; also sheet 1,2,3,4
IR0: D8.1(A) ; also sheet 1,2,3,4
IR1: D8.2(B) ; also sheet 1,2,3,4
IR2: D8.3(C) ; also sheet 1,2,3,4
IR7: D8.4(!G2A) D8.5(!G2B) ; also sheet 1
N$70: RD61.1 XOX.A
N$71: RD62.1 XOY.A
N$72: RD63.1 XOA.A
N$73: RD64.1 XOV.A
N$74: NOX.A RD65.1
N$75: NOY.A RD66.1
N$76: NOA.A RD67.1
N$77: NOV.A RD68.1
NOA: D8.9(Y6) RD67.2 ; also sheet 1
NOV: D8.7(Y7) RD68.2 ; also sheet 1
NOX: D8.11(Y4) RD65.2 ; also sheet 1
NOY: D8.10(Y5) RD66.2 ; also sheet 1
VCC: D8.6(G1) D8.16(+UB) ; also sheet 1,2,3,4
XOA: D8.13(Y2) RD63.2 ; also sheet 1
XOV: D8.12(Y3) RD64.2 ; also sheet 1
XOX: D8.15(Y0) RD61.2 ; also sheet 1
XOY: D8.14(Y1) RD62.2 ; also sheet 1

### Notes on the sheet
- DEC 8
- Decoder
- 5.4 | 1.0

## Library data of the parts
ADA ADI ADV ADX ADY ANA ANV ANX ANY CALL CLA CLX CLY CMA CMV CMX CMY HLT JE JG JL JN JNZ JZ LD0 LD1-LD7 LDA LDAI LDX LDXI LDY LDYI LIR0 LIR1-LIR7 MAX MAY MXA MXY MYA MYX NOA NOP NOV NOX NOY ORA ORV ORX ORY OUA OUX OUY RET STA STX STY SUA SUI SUV SUX SUY XOA XOV XOX XOY = led:LED: LED OSRAM: - CHIPLED LG R971, LG N971, LY N971, LG Q971, LY Q971, LO R971, LY R971 LH N974, LH R974 LS Q976, LO Q976, LY Q976 LO Q996 - Hyper CHIPLED LW Q18S LB Q993, LB Q99A, LB R99A - SideLED LS A670, LO A670, LY A670, LG A670, LP A670 LB A673, LV A673, LT A673, LW A673 LH A674 LY A675 LS A676, LA A676, LO A676, LY A676, LW A676 LS A679, LY A679, LG A679 - Hyper Micro SIDELED® LS Y876, LA Y876, LO Y876, LY Y876 LT Y87S - SmartLED LW L88C, LW L88S LB L89C, LB L89S, LG L890 LS L89K, LO L89K, LY L89K LS L896, LA L896, LO L896, LY L896 - TOPLED LS T670, LO T670, LY T670, LG T670, LP T670 LSG T670, LSP T670, LSY T670, LOP T670, LYG T670 LG T671, LOG T671, LSG T671 LB T673, LV T673, LT T673, LW T673 LH T674 LS T676, LA T676, LO T676, LY T676, LB T676, LH T676, LSB T676, LW T676 LB T67C, LV T67C, LT T67C, LS T67K, LO T67K, LY T67K, LW E67C LS E67B, LA E67B, LO E67B, LY E67B, LB E67C, LV E67C, LT E67C LW T67C LS T679, LY T679, LG T679 LS T770, LO T770, LY T770, LG T770, LP T770 LB T773, LV T773, LT T773, LW T773 LH T774 LS E675, LA E675, LY E675, LS T675 LS T776, LA T776, LO T776, LY T776, LB T776 LHGB T686 LT T68C, LB T68C - Hyper Mini TOPLED® LB M676 - Mini TOPLED Santana® LG M470 LS M47K, LO M47K, LY M47K Source: http://www.osram.convergy.de LUXEON: - LUMILED® LXK2-PW12-R00, LXK2-PW12-S00, LXK2-PW14-U00, LXK2-PW14-V00 LXK2-PM12-R00, LXK2-PM12-S00, LXK2-PM14-U00 LXK2-PE12-Q00, LXK2-PE12-R00, LXK2-PE12-S00, LXK2-PE14-T00, LXK2-PE14-U00 LXK2-PB12-K00, LXK2-PB12-L00, LXK2-PB12-M00, LXK2-PB14-N00, LXK2-PB14-P00, LXK2-PB14-Q00 LXK2-PR12-L00, LXK2-PR12-M00, LXK2-PR14-Q00, LXK2-PR14-R00 LXK2-PD12-Q00, LXK2-PD12-R00, LXK2-PD12-S00 LXK2-PH12-R00, LXK2-PH12-S00 LXK2-PL12-P00, LXK2-PL12-Q00, LXK2-PL12-R00 Source: www.luxeon.com KINGBRIGHT: KA-3528ASYC Source: www.kingbright.com
BUS INC1 INC2 INC7 INC8 = pinhead:PINHD-1X8: PIN HEADER
C1-C11 = rcl:CPOL-EU: POLARIZED CAPACITOR, European symbol; SPICEPREFIX: C
CP = pinhead:PINHD-1X1: PIN HEADER
D0 D1-D8 SELECTOR = 74ttl-din:74*138: 3-line to 8-line DECODER/DEMULTIPLEXER
INC0 = pinhead:PINHD-1X7: PIN HEADER
INC3 INC4 = pinhead:PINHD-1X5: PIN HEADER
INC5 INC6 = pinhead:PINHD-1X6: PIN HEADER
IR = 74ttl-din:74*273: Octal D type FLIP FLOP, clear
PS = pinhead:PINHD-1X2: PIN HEADER
RD0 RD1-RD68 RIR0 RIR1-RIR7 = rcl:R-EU_: RESISTOR, European symbol; SPICEPREFIX: R

## Board
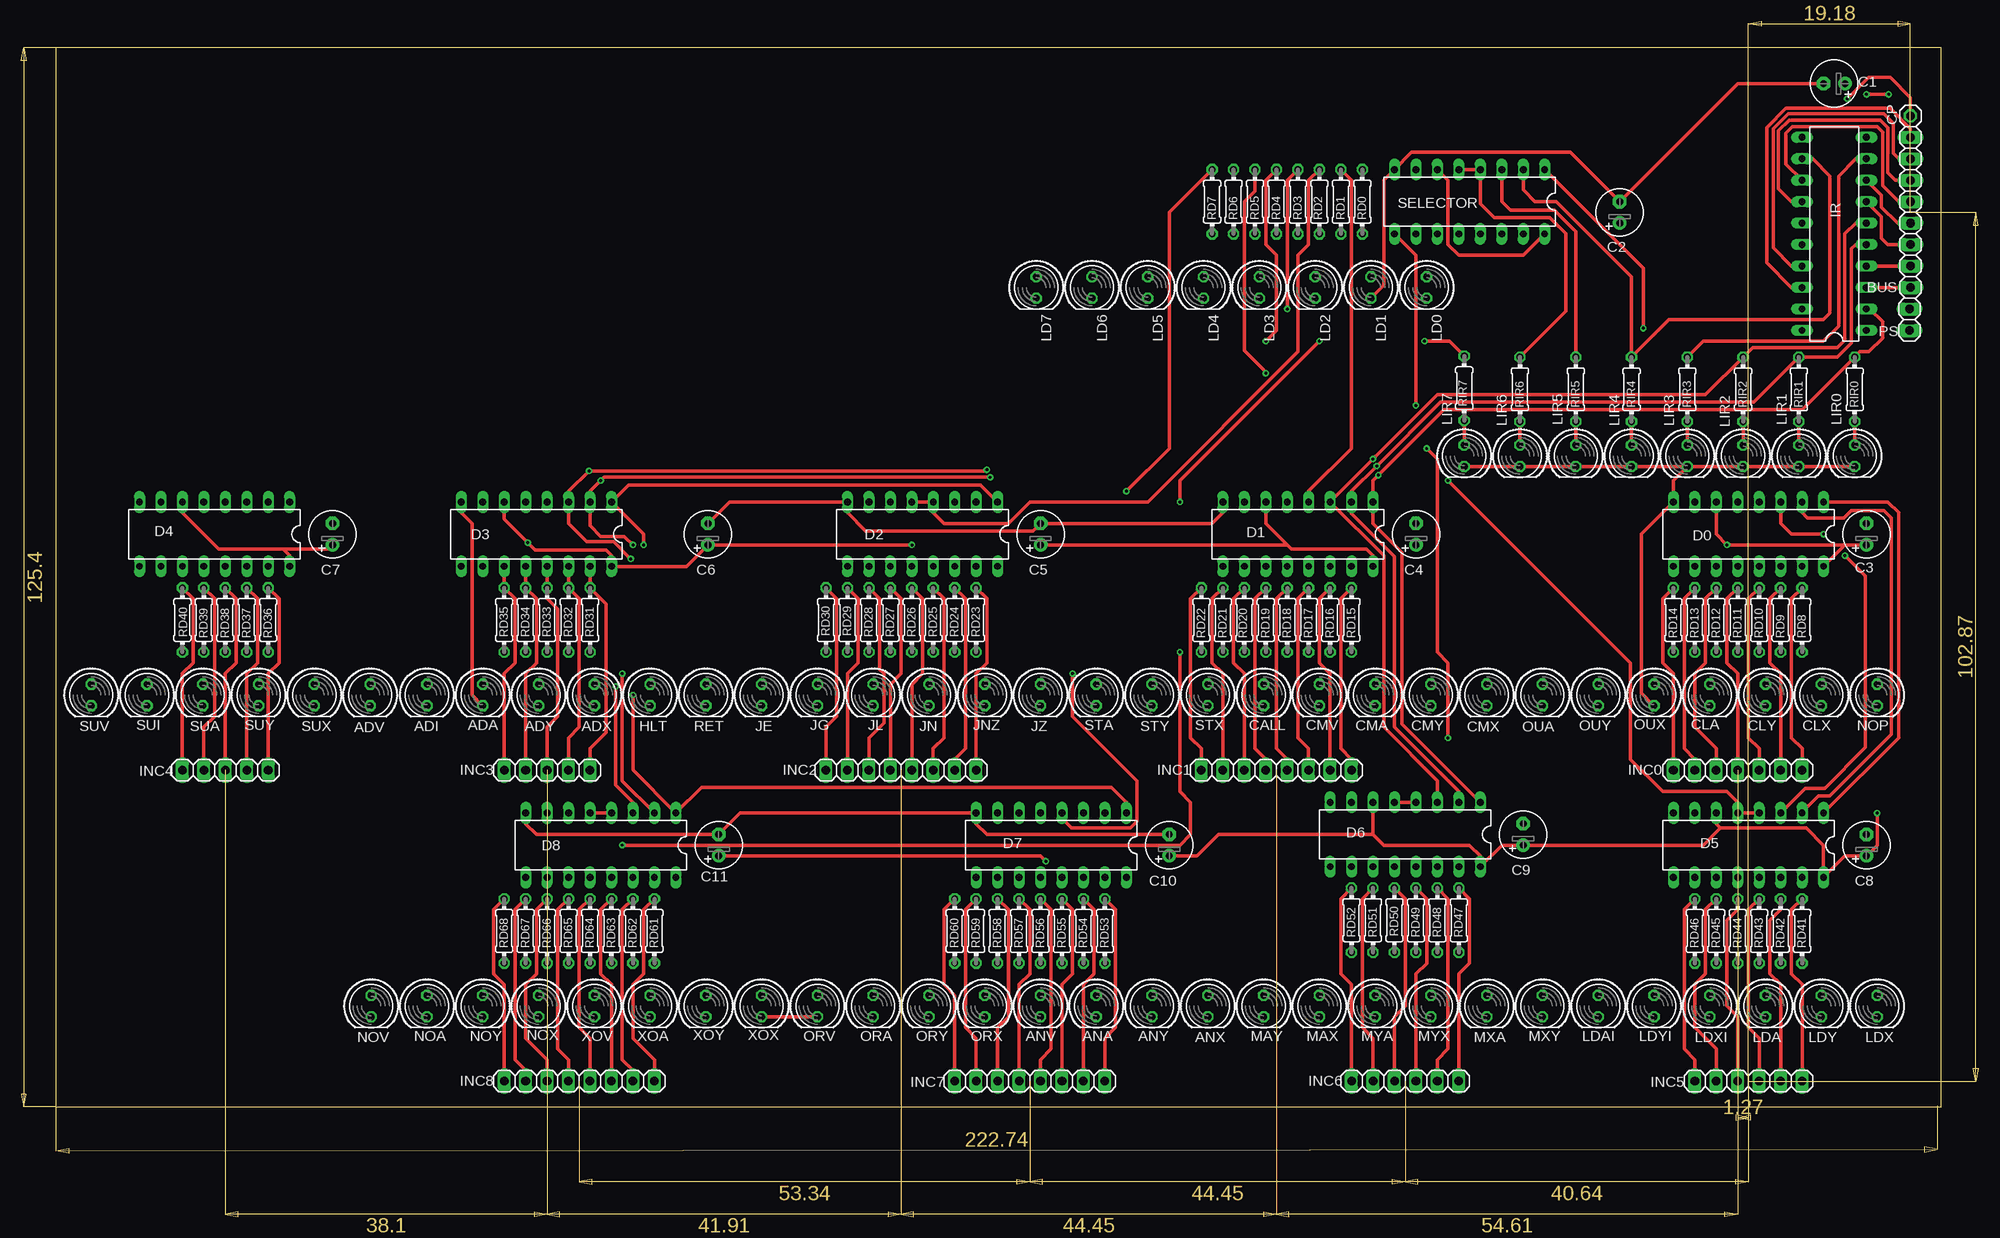
[diagram p5: board, top side]
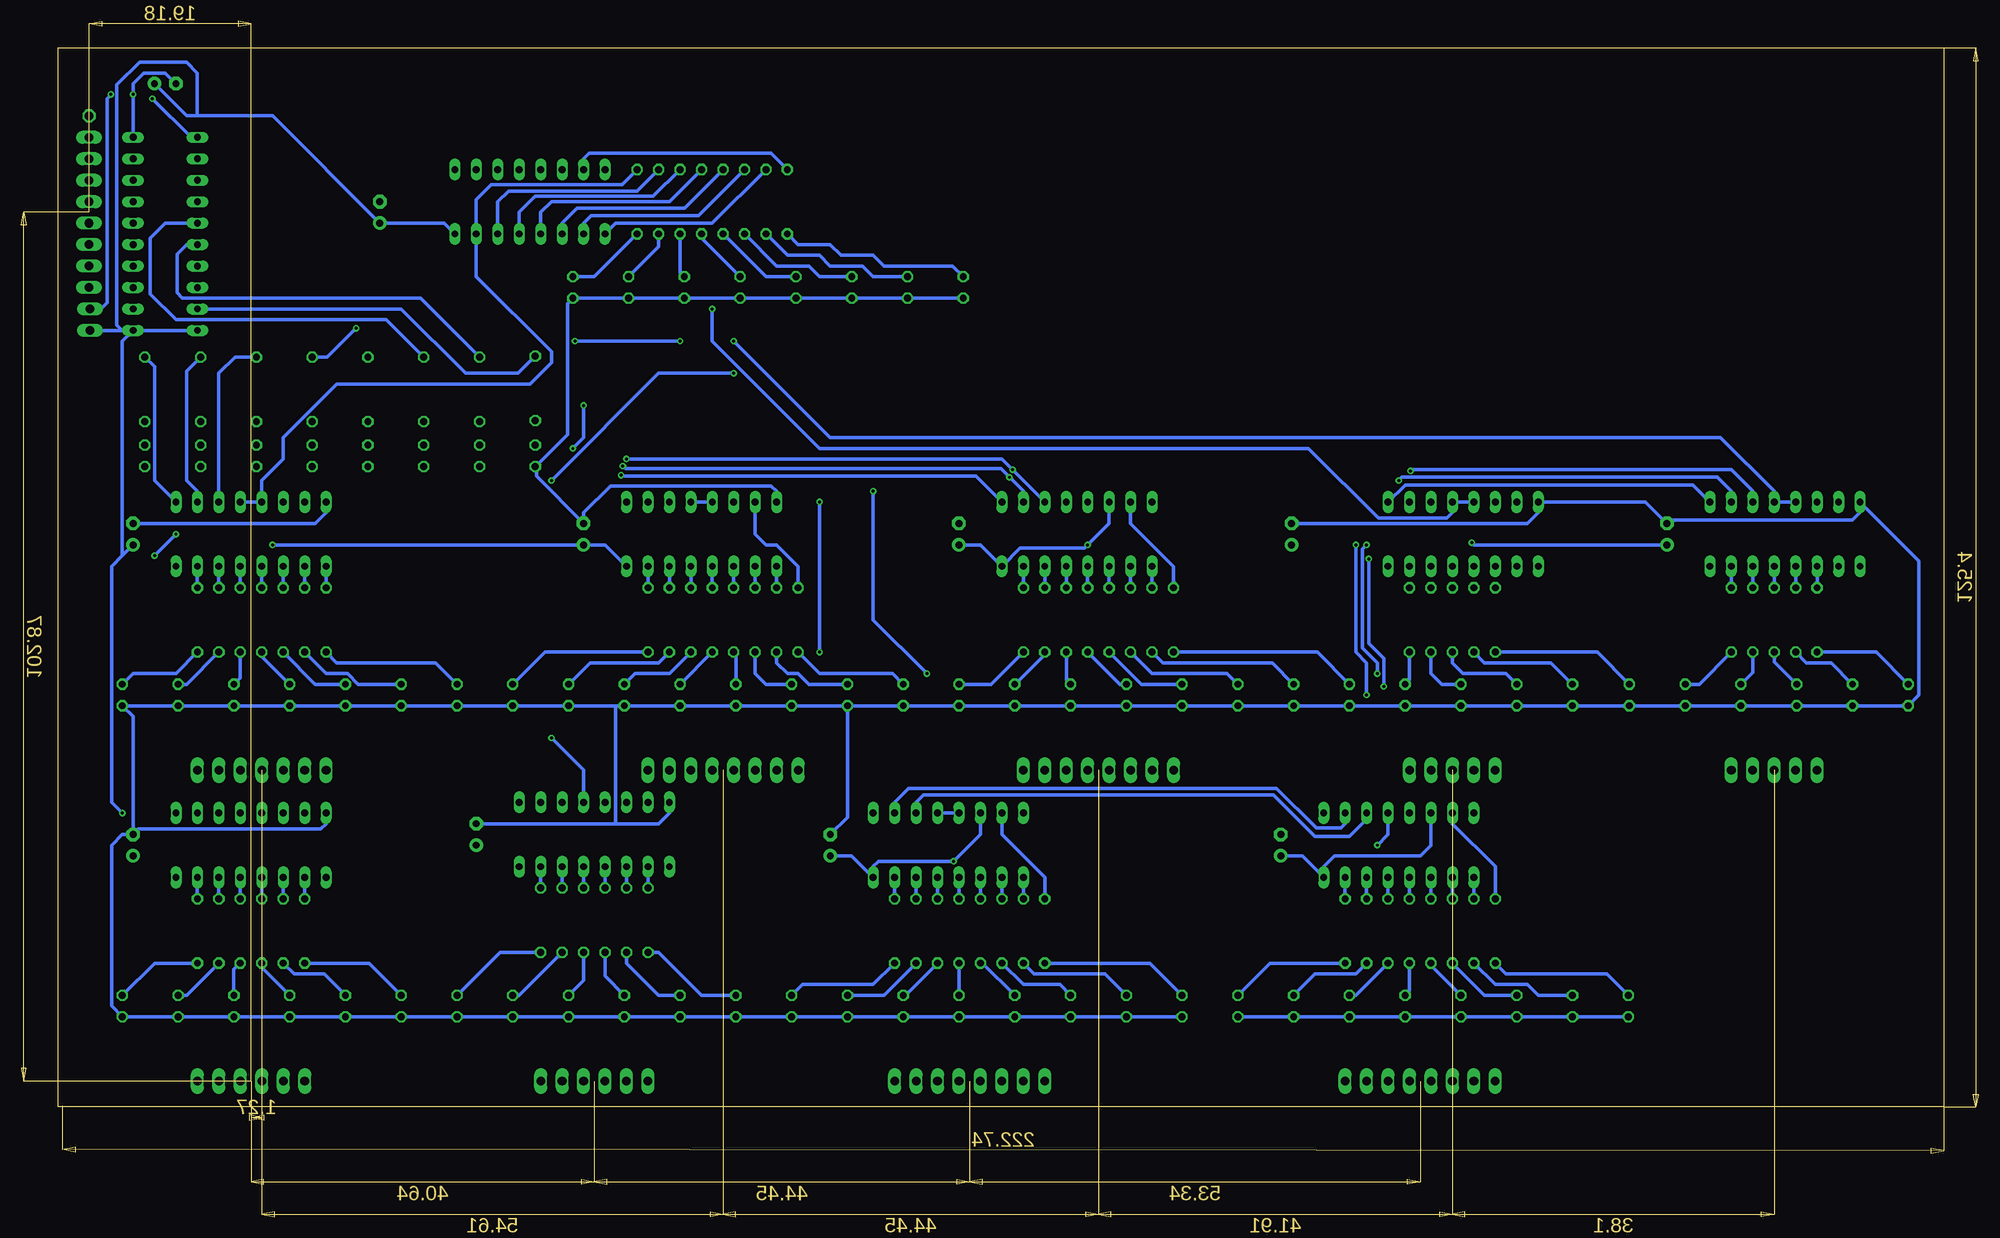
[diagram p6: board, bottom side, seen from below]

Size 223.25 x 125.4 mm. Coordinates in mm from the lower left corner, seen from the top.
Outline: 0,0 223.25,0 223.25,125.4 0,125.4 0,0
Copper layers (1*16): Top 0.035mm / dielectric 1.5mm / Bottom 0.035mm
Design rules "default": minimum track width 6mil, minimum drill 0.35mm, track to track 6mil, track to pad 6mil, pad to pad 6mil, via to via 6mil, smd to smd 6mil, copper to edge 40mil, drill to drill 6mil, minimum pad ring 10mil, minimum via ring 8mil, stop-mask expansion 4mil, vias tented up to drill 0mil, thermal gap 10mil

### Footprints (pad centres in the part's own frame; a part is rotated, then mirrored left to right if it is on the bottom)
LED5MM = drill 0.813 octagon: A -1.27,0; K 1.27,0
1X08 = drill 1.016 long: 1 -8.89,0; 2 -6.35,0; 3 -3.81,0; 4 -1.27,0; 5 1.27,0; 6 3.81,0; 7 6.35,0; 8 8.89,0
E2,5-6 = drill 0.813 pad 1.6: + -1.27,0 | drill 0.813 pad 1.6 octagon: - 1.27,0
1X01 = drill 1.016 octagon: 1 0,0
DIL16 = drill 0.813 long: 1 -8.89,-3.81; 2 -6.35,-3.81; 3 -3.81,-3.81; 4 -1.27,-3.81; 5 1.27,-3.81; 6 3.81,-3.81; 7 6.35,-3.81; 8 8.89,-3.81; 9 8.89,3.81; 10 6.35,3.81; 11 3.81,3.81; 12 1.27,3.81; 13 -1.27,3.81; 14 -3.81,3.81; 15 -6.35,3.81; 16 -8.89,3.81
1X07 = drill 1.016 long: 1 -7.62,0; 2 -5.08,0; 3 -2.54,0; 4 0,0; 5 2.54,0; 6 5.08,0; 7 7.62,0
1X05 = drill 1.016 long: 1 -5.08,0; 2 -2.54,0; 3 0,0; 4 2.54,0; 5 5.08,0
1X06 = drill 1.016 long: 1 -6.35,0; 2 -3.81,0; 3 -1.27,0; 4 1.27,0; 5 3.81,0; 6 6.35,0
DIL20 = drill 0.813 long: 1 -11.43,-3.81; 2 -8.89,-3.81; 3 -6.35,-3.81; 4 -3.81,-3.81; 5 -1.27,-3.81; 6 1.27,-3.81; 7 3.81,-3.81; 8 6.35,-3.81; 9 8.89,-3.81; 10 11.43,-3.81; 11 11.43,3.81; 12 8.89,3.81; 13 6.35,3.81; 14 3.81,3.81; 15 1.27,3.81; 16 -1.27,3.81; 17 -3.81,3.81; 18 -6.35,3.81; 19 -8.89,3.81; 20 -11.43,3.81
1X02 = drill 1.016 long: 1 -1.27,0; 2 1.27,0
0204/7 = drill 0.813 octagon: 1 -3.81,0; 2 3.81,0

### Placement (x,y rotation side)
ADA  50.55,48.77 270 top
ADI  43.94,48.77 270 top
ADV  37.21,48.77 270 top
ADX  63.75,48.77 270 top
ADY  57.15,48.77 270 top
ANA  123.19,11.94 270 top
ANV  116.59,11.94 270 top
ANX  136.4,11.94 270 top
ANY  129.79,11.94 270 top
BUS  219.58,105.92 270 top
C1  210.57,121.16 180 top
C2  185.17,105.92 90 top
C3  214.38,67.82 90 top
C4  161.04,67.82 90 top
C5  116.59,67.82 90 top
C6  77.22,67.82 90 top
C7  32.77,67.82 90 top
C8  214.38,30.99 90 top
C9  173.74,32.26 90 top
C10  131.83,30.99 90 top
C11  78.49,30.99 90 top
CALL  143,48.77 270 top
CLA  195.83,48.77 270 top
CLX  209.04,48.77 270 top
CLY  202.44,48.77 270 top
CMA  156.21,48.77 270 top
CMV  149.61,48.77 270 top
CMX  169.42,48.77 270 top
CMY  162.81,48.77 270 top
CP  219.58,117.35 0 top
D0  200.41,67.82 180 top
D1  147.07,67.82 180 top
D2  102.62,67.82 180 top
D3  56.9,67.82 180 top
D4  18.8,67.82 180 top
D5  200.41,30.99 180 top
D6  159.77,32.26 180 top
D7  117.86,30.99 180 top
D8  64.52,30.99 180 top
HLT  70.36,48.77 270 top
INC0  199.14,39.88 0 top
INC1  144.53,39.88 0 top
INC2  100.08,39.88 0 top
INC3  58.17,39.88 0 top
INC4  20.07,39.88 0 top
INC5  200.41,3.05 0 top
INC6  159.77,3.05 0 top
INC7  115.32,3.05 0 top
INC8  61.98,3.05 0 top
IR  210.57,103.38 90 top
JE  83.57,48.77 270 top
JG  90.17,48.77 270 top
JL  96.77,48.77 270 top
JN  103.38,48.77 270 top
JNZ  109.98,48.77 270 top
JZ  116.59,48.77 270 top
LD0  162.31,97.03 270 top
LD1  155.7,97.03 270 top
LD2  149.1,97.03 270 top
LD3  142.49,97.03 270 top
LD4  135.89,97.03 270 top
LD5  129.29,97.03 270 top
LD6  122.68,97.03 270 top
LD7  116.08,97.03 270 top
LDA  202.44,11.94 270 top
LDAI  182.63,11.94 270 top
LDX  215.65,11.94 270 top
LDXI  195.83,11.94 270 top
LDY  209.04,11.94 270 top
LDYI  189.23,11.94 270 top
LIR0  212.98,77.09 270 top
LIR1  206.38,77.09 270 top
LIR2  199.77,77.09 270 top
LIR3  193.17,77.09 270 top
LIR4  186.56,77.09 270 top
LIR5  179.96,77.09 270 top
LIR6  173.35,77.09 270 top
LIR7  166.75,77.09 270 top
MAX  149.61,11.94 270 top
MAY  143,11.94 270 top
MXA  169.42,11.94 270 top
MXY  176.02,11.94 270 top
MYA  156.21,11.94 270 top
MYX  162.81,11.94 270 top
NOA  43.94,11.94 270 top
NOP  215.65,48.77 270 top
NOV  37.34,11.94 270 top
NOX  57.15,11.94 270 top
NOY  50.55,11.94 270 top
ORA  96.77,11.94 270 top
ORV  90.17,11.94 270 top
ORX  109.98,11.94 270 top
ORY  103.38,11.94 270 top
OUA  176.02,48.77 270 top
OUX  189.23,48.77 270 top
OUY  182.63,48.77 270 top
PS  219.46,93.22 270 top
RD0  154.69,107.19 90 top
RD1  152.15,107.19 90 top
RD2  149.61,107.19 90 top
RD3  147.07,107.19 90 top
RD4  144.53,107.19 90 top
RD5  141.99,107.19 90 top
RD6  139.45,107.19 90 top
RD7  136.91,107.19 90 top
RD8  206.76,57.66 90 top
RD9  204.22,57.66 90 top
RD10  201.68,57.66 90 top
RD11  199.14,57.66 90 top
RD12  196.6,57.66 90 top
RD13  194.06,57.66 90 top
RD14  191.52,57.66 90 top
RD15  153.42,57.66 90 top
RD16  150.88,57.66 90 top
RD17  148.34,57.66 90 top
RD18  145.8,57.66 90 top
RD19  143.26,57.66 90 top
RD20  140.72,57.66 90 top
RD21  138.18,57.66 90 top
RD22  135.64,57.66 90 top
RD23  108.97,57.66 90 top
RD24  106.43,57.66 90 top
RD25  103.89,57.66 90 top
RD26  101.35,57.66 90 top
RD27  98.81,57.66 90 top
RD28  96.27,57.66 90 top
RD29  93.73,57.66 90 top
RD30  91.19,57.66 90 top
RD31  63.25,57.66 90 top
RD32  60.71,57.66 90 top
RD33  58.17,57.66 90 top
RD34  55.63,57.66 90 top
RD35  53.09,57.66 90 top
RD36  25.15,57.66 90 top
RD37  22.61,57.66 90 top
RD38  20.07,57.66 90 top
RD39  17.53,57.66 90 top
RD40  14.99,57.66 90 top
RD41  206.76,20.83 90 top
RD42  204.22,20.83 90 top
RD43  201.68,20.83 90 top
RD44  199.14,20.83 90 top
RD45  196.6,20.83 90 top
RD46  194.06,20.83 90 top
RD47  166.12,22.1 90 top
RD48  163.58,22.1 90 top
RD49  161.04,22.1 90 top
RD50  158.5,22.1 90 top
RD51  155.96,22.1 90 top
RD52  153.42,22.1 90 top
RD53  124.21,20.83 90 top
RD54  121.67,20.83 90 top
RD55  119.13,20.83 90 top
RD56  116.59,20.83 90 top
RD57  114.05,20.83 90 top
RD58  111.51,20.83 90 top
RD59  108.97,20.83 90 top
RD60  106.43,20.83 90 top
RD61  70.87,20.83 90 top
RD62  68.33,20.83 90 top
RD63  65.79,20.83 90 top
RD64  63.25,20.83 90 top
RD65  60.71,20.83 90 top
RD66  58.17,20.83 90 top
RD67  55.63,20.83 90 top
RD68  53.09,20.83 90 top
RET  76.96,48.77 270 top
RIR0  212.98,84.96 90 top
RIR1  206.38,84.96 90 top
RIR2  199.77,84.96 90 top
RIR3  193.17,84.96 90 top
RIR4  186.56,84.96 90 top
RIR5  179.96,84.96 90 top
RIR6  173.35,84.96 90 top
RIR7  166.75,85.09 90 top
SELECTOR  167.39,107.19 180 top
STA  123.19,48.77 270 top
STX  136.4,48.77 270 top
STY  129.79,48.77 270 top
SUA  17.4,48.77 270 top
SUI  10.79,48.77 270 top
SUV  4.19,48.77 270 top
SUX  30.61,48.77 270 top
SUY  24,48.77 270 top
XOA  70.36,11.94 270 top
XOV  63.75,11.94 270 top
XOX  83.57,11.94 270 top
XOY  76.96,11.94 270 top

### Tracks (layer width: path | path; a pad name or v marks a point on that pad's centre or on a via)
ADA
  Top 0.4: INC3.3 58.17,44.96 59.44,46.23 59.44,58.93 58.17,60.2 RD33.2 D3.13
ADI
  Top 0.4: INC3.2 55.63,51.31 56.9,52.58 56.9,60.2 RD34.2 D3.12
ADV
  Top 0.4: INC3.1 53.09,51.31 54.36,52.58 54.36,60.2 RD35.2 D3.11
ADX
  Top 0.4: INC3.5 63.25,42.42 65.15,44.32 65.15,59.56 RD31.2 D3.15
ADY
  Top 0.4: INC3.4 60.71,43.69 61.98,44.96 61.98,60.2 RD32.2 D3.14
ANA
  Top 0.4: INC7.6 119.13,14.48 120.4,15.75 120.4,23.37 RD55.2
  Bottom 0.4: RD55.2 D7.13
ANV
  Top 0.4: RD56.2 117.86,23.37 117.86,6.86 116.59,5.59 INC7.5
  Bottom 0.4: D7.12 RD56.2
ANX
  Top 0.4: INC7.8 124.21,8.13 125.48,9.4 125.48,23.37 RD53.2
  Bottom 0.4: D7.15 RD53.2
ANY
  Top 0.4: RD54.2 122.94,23.37 122.94,15.75 121.67,14.48 INC7.7
  Bottom 0.4: D7.14 RD54.2
B0
  Top 0.4: BUS.8 IR.3
B1
  Top 0.4: IR.4 BUS.7
B2
  Top 0.4: BUS.6 216.92,102.11 216.15,102.87 216.15,105.41 IR.7
B3
  Top 0.4: IR.8 216.15,107.95 216.15,106.55 218.06,104.65 BUS.5
B4
  Top 0.4: BUS.4 218.19,107.19 216.28,109.09 216.28,115.44 215.65,116.08 205.61,116.08 204.85,115.32 204.85,111.63 IR.13
B5
  Top 0.4: IR.14 205.49,107.19 203.96,108.71 203.96,115.57 205.23,116.84 216.03,116.84 216.92,115.95 216.92,110.62 217.81,109.73 BUS.3
B6
  Top 0.4: BUS.2 218.19,112.27 217.55,112.9 217.55,116.46 216.41,117.6 205.1,117.6 203.33,115.82 203.33,101.73 205.49,99.57 IR.17
B7
  Top 0.4: IR.18 205.49,97.03 202.56,99.95 202.56,115.95 204.85,118.24 217.17,118.24 219.58,115.82 BUS.1
CALL
  Top 0.4: RD19.2 141.99,60.2 141.99,42.42 143.26,41.15 INC1.4
  Bottom 0.4: RD19.2 D1.11
CLA
  Top 0.4: INC0.4 199.14,51.31 197.87,52.58 197.87,60.2 RD11.2
  Bottom 0.4: D0.12 RD11.2
CLX
  Top 0.4: INC0.6 204.22,51.31 202.95,52.58 202.95,60.2 RD9.2
  Bottom 0.4: D0.14 RD9.2
CLY
  Top 0.4: RD10.2 200.41,60.2 200.41,43.69 201.68,42.42 INC0.5
  Bottom 0.4: RD10.2 D0.13
CMA
  Top 0.4: RD17.2 147.07,60.2 147.07,43.69 148.34,42.42 INC1.6
  Bottom 0.4: RD17.2 D1.13
CMV
  Top 0.4: INC1.5 145.8,41.15 144.53,42.42 144.53,60.2 RD18.2
  Bottom 0.4: D1.12 RD18.2
CMX
  Top 0.4: RD15.2 152.15,60.2 152.15,42.42 153.42,41.15 INC1.8
  Bottom 0.4: RD15.2 D1.15
CMY
  Top 0.4: INC1.7 150.88,51.31 149.61,52.58 149.61,60.2 RD16.2
  Bottom 0.4: D1.14 RD16.2
D0
  Bottom 0.4: RD0.2 156.46,109.22 171.96,109.22 173.74,107.44 SELECTOR.15 173.74,98.3 164.85,89.41 164.85,88.14 167.39,85.6 190.25,85.6 196.6,79.25 196.6,76.71 199.14,74.17 D0.5 D0.4
D1
  Top 0.4: RD1.2 153.42,109.73 153.42,77.98 148.34,72.9 D1.4
  Bottom 0.4: RD1.2 154.69,108.46 169.93,108.46 171.2,107.19 SELECTOR.14 | D1.5 D1.4
D2
  Top 0.4: D2.5 D2.4 103.89,70.36 105.16,69.09 112.78,69.09 115.32,71.63 129.29,71.63 147.07,89.41 147.07,100.84 148.34,102.11 148.34,109.73 RD2.2
  Bottom 0.4: RD2.2 152.78,107.82 166.75,107.82 168.66,105.92 SELECTOR.13
D3  (via drill 0.35)
  Top 0.4: RD3.2 145.8,109.73 v145.8,94.49
  Bottom 0.4: RD3.2 150.88,107.19 164.85,107.19 166.12,105.92 SELECTOR.12 | D3.5 D3.4 58.17,70.36 58.8,69.72 66.93,69.72 75.18,77.98 133.1,77.98 145.8,90.68 v145.8,94.49
D4  (via drill 0.35)
  Top 0.4: v143.26,90.68 144.53,91.95 144.53,100.84 143.26,102.11 143.26,109.73 RD4.2
  Bottom 0.4: RD4.2 149.1,106.43 161.8,106.43 163.58,104.65 SELECTOR.11 | D4.5 D4.4 20.07,72.9 26.42,79.25 131.83,79.25 v143.26,90.68
D5  (via drill 0.35)
  Top 0.4: D5.4 D5.5 199.14,36.07 197.87,37.34 190.25,37.34 186.44,41.15 186.44,52.58 v164.85,74.17 | RD5.2 141.99,108.46 140.72,107.19 140.72,89.53 143.26,87 v143.26,86.87
  Bottom 0.4: SELECTOR.10 161.04,104.65 160.15,105.54 147.45,105.54 RD5.2 | v143.26,86.87 152.15,86.87 v164.85,74.17
D6  (via drill 0.35)
  Top 0.4: D6.5 D6.4 | SELECTOR.9 161.04,100.84 v161.04,83.06 | v162.31,77.98 163.58,76.71 163.58,53.85 164.85,52.58 v164.85,43.69
  Bottom 0.4: SELECTOR.9 157.23,104.65 145.8,104.65 RD6.2 | v161.04,83.06 161.04,79.25 v162.31,77.98 | v164.85,43.69 161.04,39.88 D6.4
D7  (via drill 0.35)
  Top 0.4: RD7.2 131.83,105.92 131.83,77.98 v126.75,72.9 | v120.4,51.31 120.4,46.23 128.02,38.61 128.02,33.78 127.25,33.02 120.27,33.02 119.13,34.16 D7.4
  Bottom 0.4: SELECTOR.7 161.04,112.27 160.4,112.9 138.81,112.9 RD7.2 | D7.5 D7.4 | v126.75,72.9 126.75,57.66 v120.4,51.31
GND  (via drill 0.35)
  Top 0.4: LIR7.K LIR6.K LIR5.K LIR4.K LIR3.K | LIR3.K LIR2.K LIR1.K LIR0.K | OUX.K 187.71,49.02 187.71,67.82 D0.8 191.52,74.17 LIR3.K | D1.8 138.18,70.36 136.91,69.09 C5.- 115.7,68.2 95.89,68.2 93.73,70.36 D2.8 79.76,71.63 C6.- | ADA.K 49.28,48.77 49.28,69.09 48.01,70.36 D3.8 | C1.- 199.14,121.16 C2.- 179.32,113.03 160.53,113.03 SELECTOR.8 157.23,109.73 157.23,97.28 LD1.K | v217.01,119.89 v214.38,119.89 | C10.- 110.24,32.26 108.97,33.53 D7.8 81.03,34.8 C11.- 56.9,32.26 55.63,33.53 D8.8 | XOX.K ORV.K
  Bottom 0.4: LD7.K LD6.K LD5.K LD4.K LD3.K LD2.K LD1.K LD0.K 162.94,95.12 162.94,79.63 166.62,75.95 | LIR7.K 166.62,75.95 | 157.23,47.5 CMY.K CMX.K OUA.K OUY.K OUX.K CLA.K CLY.K CLX.K NOP.K 214.38,46.23 C8.- | 157.23,47.5 CMA.K CMV.K CALL.K STX.K STY.K | STY.K STA.K JZ.K JNZ.K JN.K JL.K JG.K JE.K RET.K HLT.K ADX.K ADY.K ADA.K ADI.K ADV.K SUX.K SUY.K SUA.K SUI.K SUV.K 2.92,48.77 2.92,64.64 D4.8 9.91,70.36 10.79,69.47 32.38,69.47 C7.- 35.31,71.63 D3.8 48.01,70.36 49.28,69.09 C6.- | D0.8 191.52,70.36 192.79,69.09 C3.- | D1.8 138.18,72.9 138.81,73.53 157.86,73.53 161.04,70.36 C4.- 166.62,74.68 166.62,75.95 | C1.- 210.57,122.43 213.11,122.43 214.38,121.16 v214.38,119.89 IR.10 | PS.1 218.19,94.49 217.42,95.25 217.42,119.38 216.92,119.89 v217.01,119.89 | D5.8 191.52,33.53 192.15,32.89 213.74,32.89 C8.- | C8.- 215.65,32.26 216.92,30.99 216.92,11.94 LDX.K LDY.K LDA.K LDXI.K LDYI.K LDAI.K MXY.K MXA.K MYX.K MYA.K MAX.K MAY.K ANX.K ANY.K ANA.K ANV.K ORX.K ORY.K ORA.K ORV.K | D6.8 150.88,34.8 152.15,33.53 157.23,33.53 | 157.23,33.53 C9.- | 157.23,33.53 157.23,47.5 | NOV.K NOA.K NOY.K NOX.K XOV.K XOA.K XOY.K XOX.K | C10.- 129.79,34.29 STY.K
HLT
  Top 0.4: RD30.2 92.46,60.2 92.46,46.23 91.19,44.96 INC2.1
  Bottom 0.4: RD30.2 91.19,64.01 96.27,69.09 D2.7
IR0  (via drill 0.35)
  Top 0.4: IR.2 214.76,94.49 216.28,92.96 216.28,91.06 214.63,89.41 213.61,89.41 RIR0.2 206.76,82.55 164.34,82.55 v156.59,74.8 155.96,74.17 D1.1 155.96,69.09 159.38,65.66 159.38,45.34 D6.1 | D2.1 109.47,73.66 67.82,73.66 D3.1 69.6,67.82 v69.6,66.55 | D5.1 218.19,43.69 218.19,70.36 216.92,71.63 D0.1 | D7.1 126.75,36.07 124.97,37.85 76.45,37.85 D8.1 68.33,39.88 v68.33,48.77
  Bottom 0.4: D0.1 211.84,74.17 211.84,87.63 RIR0.2 | D2.1 114.55,74.68 156.46,74.68 v156.59,74.8 | D4.1 29.72,73.66 63.75,73.66 D3.1 | v69.6,66.55 69.6,53.85 68.33,52.58 v68.33,48.77
IR1  (via drill 0.35)
  Top 0.4: IR.5 213.11,102.11 212.6,101.6 212.6,90.42 210.95,88.77 RIR1.2 201.04,83.44 163.96,83.44 v156.4,75.88 153.42,72.9 D1.2 153.42,70.23 158.5,65.15 158.5,44.96 166.12,37.34 D6.2 | v110.62,74.55 64.9,74.55 v64.52,74.17 63.25,72.9 D3.2 63.25,68.83 64.52,67.56 67.31,67.56 v68.33,66.55 | D0.2 206.76,70.36 207.39,69.72 211.71,69.72 212.6,70.61 216.41,70.61 217.3,69.72 217.3,44.07 210.06,36.83 208.66,36.83 206.76,34.92 D5.2 | D8.2 67.06,38.61 v67.06,51.31
  Bottom 0.4: D0.2 206.76,72.9 208.03,74.17 208.03,87.12 RIR1.2 | D2.2 108.97,72.9 v110.62,74.55 111.63,75.56 156.08,75.56 v156.4,75.88 | D4.2 25.15,72.9 26.8,74.55 64.14,74.55 v64.52,74.17 | D8.2 70.87,33.53 71.37,33.02 74.3,33.02 78.99,37.72 122.56,37.72 124.21,36.07 D7.2 | v67.06,51.31 67.06,52.58 68.83,54.36 68.83,66.04 v68.33,66.55
IR2  (via drill 0.35)
  Top 0.4: IR.6 213.11,104.65 211.84,103.38 211.84,90.81 210.95,89.92 200.91,89.92 RIR2.2 195.33,84.33 163.58,84.33 155.96,76.71 | 155.96,76.71 D1.3 157.23,65.28 157.23,44.96 163.58,38.61 D6.3 | v155.95,76.72 155.96,76.71 | v110.23,75.45 110.09,75.31 v63.12,75.31 60.71,72.9 D3.3 60.71,69.09 62.87,66.93 66.04,66.93 v68.07,64.9 | D5.3 207.14,37.72 209.42,37.72 214.25,42.55 214.25,62.87 v211.84,65.28 | v209.3,67.82 205.49,67.82 204.22,69.09 D0.3 | v66.29,49.78 66.29,38.1 68.33,36.07 D8.3
  Bottom 0.4: D0.3 204.22,86.87 202.31,88.77 RIR2.2 | D2.3 110.24,75.44 | 110.24,75.44 111.51,76.71 155.94,76.71 v155.95,76.72 | v110.23,75.45 110.24,75.44 | D4.3 22.61,72.9 25.15,75.44 62.99,75.44 v63.12,75.31 | v211.84,65.28 v209.3,67.82 | D7.3 121.67,36.07 120.78,36.96 79.38,36.96 74.42,32 70.36,32 68.33,34.04 D8.3 | v68.07,64.9 68.07,54.86 66.29,53.09 v66.29,49.78
IR3  (via drill 0.35)
  Top 0.4: RIR3.2 195.07,90.68 209.3,90.68 211.07,92.46 211.07,110.24 213.11,112.27 IR.9 | SELECTOR.1 187.96,99.31 v187.96,92.2
  Bottom 0.4: v187.96,92.2 191.39,88.77 RIR3.2
IR4
  Top 0.4: IR.12 208.03,112.27 210.06,110.24 210.06,93.98 209.3,93.22 191.01,93.22 RIR4.2 186.56,98.3 177.67,107.19 175.13,107.19 173.74,108.58 SELECTOR.2
IR5
  Top 0.4: SELECTOR.3 171.2,107.19 172.21,106.17 177.42,106.17 179.96,103.63 RIR5.2
  Bottom 0.4: RIR5.2 184.4,93.22 209.3,93.22 212.34,96.27 212.34,102.87 210.57,104.65 IR.15
IR6
  Top 0.4: RIR6.2 178.82,94.23 178.82,103.38 176.91,105.28 170.31,105.28 168.66,106.93 SELECTOR.4 SELECTOR.5
  Bottom 0.4: IR.16 208.03,102.11 209.17,100.97 209.17,96.39 208.53,95.76 180.34,95.76 RIR6.2
IR7  (via drill 0.35)
  Top 0.4: D8.5 D8.4 | RIR7.2 164.97,90.68 v162.05,90.68 | v149.61,90.68 133.1,74.17 v133.1,71.63 | v133.1,53.85 133.1,37.34 134.37,36.07 134.37,32.26 133.1,30.99 v67.06,30.99
  Bottom 0.4: RIR7.2 168.78,86.87 175.01,86.87 182.63,94.49 IR.19 | v162.05,90.68 v149.61,90.68 | v133.1,71.63 v133.1,53.85 | v67.06,30.99 65.79,32.26 D8.4
IR-CP  (via drill 0.35)
  Top 0.4: CP.1 219.58,119.51 217.17,121.92 214.63,121.92 v212.09,119.38
  Bottom 0.4: IR.11 207.52,114.81 v212.09,119.38
JE
  Top 0.4: RD28.2 97.54,60.2 97.54,51.82 98.04,51.31 98.04,45.47 96.27,43.69 INC2.3
  Bottom 0.4: RD28.2 D2.10
JG
  Top 0.4: INC2.4 98.81,50.04 100.08,51.31 100.08,60.2 RD27.2
  Bottom 0.4: RD27.2 D2.11
JL
  Top 0.4: RD26.2 102.62,60.2 102.62,51.31 101.35,50.04 INC2.5
  Bottom 0.4: D2.12 RD26.2
JN
  Top 0.4: INC2.6 103.89,42.42 105.16,43.69 105.16,60.2 RD25.2
  Bottom 0.4: RD25.2 D2.13
JNZ
  Top 0.4: RD24.2 107.7,60.2 107.7,42.42 106.43,41.15 INC2.7
  Bottom 0.4: D2.14 RD24.2
JZ
  Top 0.4: RD23.2 110.24,60.2 110.24,52.58 108.97,51.31 INC2.8
  Bottom 0.4: RD23.2 D2.15
LDA
  Top 0.4: INC5.4 201.68,8.13 200.41,9.4 200.41,23.37 RD43.2
  Bottom 0.4: RD43.2 D5.13
LDAI
  Top 0.4: RD46.2 192.79,23.37 192.79,6.86 194.06,5.59 INC5.1
  Bottom 0.4: D5.10 RD46.2
LDX
  Top 0.4: INC5.6 206.76,14.48 205.49,15.75 205.49,23.37 RD41.2
  Bottom 0.4: RD41.2 D5.15
LDXI
  Top 0.4: RD44.2 199.14,23.37 197.87,22.1 197.87,11.94 199.14,10.67 INC5.3
  Bottom 0.4: D5.12 RD44.2
LDY
  Top 0.4: RD42.2 204.22,23.37 202.95,22.1 202.95,15.75 204.22,14.48 INC5.5
  Bottom 0.4: D5.14 RD42.2
LDYI
  Top 0.4: INC5.2 196.6,6.86 194.06,9.4 194.06,14.48 195.33,15.75 195.33,23.37 RD45.2
  Bottom 0.4: RD45.2 D5.11
MAX
  Top 0.4: INC6.2 155.96,8.13 154.69,9.4 154.69,24.64 RD51.2
  Bottom 0.4: D6.11 RD51.2
MAY
  Top 0.4: RD52.2 152.15,24.64 152.15,15.75 153.42,14.48 INC6.1
  Bottom 0.4: RD52.2 D6.10
MXA
  Top 0.4: RD48.2 164.85,24.64 164.85,6.86 163.58,5.59 INC6.5
  Bottom 0.4: RD48.2 D6.14
MXY
  Top 0.4: INC6.6 166.12,15.75 167.39,17.02 167.39,24.64 RD47.2
  Bottom 0.4: D6.15 RD47.2
MYA
  Top 0.4: RD50.2 159.77,24.64 159.77,11.94 158.5,10.67 INC6.3
  Bottom 0.4: RD50.2 D6.12
MYX
  Top 0.4: INC6.4 161.04,15.75 162.31,17.02 162.31,24.64 RD49.2
  Bottom 0.4: D6.13 RD49.2
N$1
  Bottom 0.4: RD0.1 159.77,98.3 LD0.A
N$2
  Bottom 0.4: LD1.A 152.15,101.85 RD1.1
N$3
  Bottom 0.4: RD2.1 149.61,98.81 LD2.A
N$4
  Bottom 0.4: LD3.A 147.07,102.87 RD3.1
N$5
  Bottom 0.4: LD4.A 139.45,98.3 RD4.1
N$6
  Bottom 0.4: LD5.A 133.1,98.3 134.37,99.57 138.18,99.57 RD5.1
N$7
  Bottom 0.4: LD6.A 126.75,98.3 128.02,99.57 131.83,99.57 133.1,100.84 136.91,100.84 RD6.1
N$8
  Bottom 0.4: RD7.1 135.64,102.11 131.83,102.11 130.56,100.84 126.75,100.84 125.48,99.57 117.35,99.57 LD7.A
N$9
  Bottom 0.4: RD15.1 165.61,53.85 CMX.A
N$10
  Top 0.4: LIR0.A RIR0.1
N$11
  Top 0.4: RIR1.1 LIR1.A
N$12
  Top 0.4: LIR2.A RIR2.1
N$13
  Top 0.4: LIR3.A RIR3.1
N$14
  Top 0.4: RIR4.1 LIR4.A
N$15
  Top 0.4: LIR5.A RIR5.1
N$16
  Top 0.4: RIR6.1 LIR6.A
N$17
  Top 0.4: RIR7.1 LIR7.A
N$18
  Bottom 0.4: CMY.A 160.27,52.58 152.15,52.58 RD16.1
N$19
  Bottom 0.4: CMA.A 154.94,51.31 150.88,51.31 RD17.1
N$20
  Bottom 0.4: CMV.A RD18.1
N$21
  Bottom 0.4: CALL.A 143,53.59 RD19.1
N$22
  Bottom 0.4: STX.A 139.45,50.04 140.72,51.31 RD20.1
N$23
  Bottom 0.4: STY.A 134.37,50.04 135.64,51.31 136.91,51.31 138.18,52.58 RD21.1
N$24
  Bottom 0.4: STA.A 124.46,51.31 133.1,51.31 RD22.1
N$25
  Bottom 0.4: RD8.1 209.3,51.31 214.38,51.31 NOP.A
N$26
  Bottom 0.4: RD9.1 208.03,50.04 CLX.A
N$27
  Bottom 0.4: RD10.1 201.68,50.8 CLY.A
N$28
  Bottom 0.4: RD11.1 199.14,53.34 CLA.A
N$29
  Bottom 0.4: RD12.1 192.79,50.04 OUX.A
N$30
  Bottom 0.4: OUY.A 187.71,50.04 188.98,51.31 191.52,51.31 RD13.1
N$31
  Bottom 0.4: RD14.1 190.25,52.58 178.56,52.58 OUA.A
N$32
  Bottom 0.4: RD23.1 112.78,50.04 JZ.A
N$33
  Bottom 0.4: RD24.1 106.43,53.59 JNZ.A
N$34
  Bottom 0.4: JN.A 103.89,50.55 RD25.1
N$35
  Bottom 0.4: JL.A 97.54,50.04 RD26.1
N$36
  Bottom 0.4: RD27.1 95,50.04 JG.A
N$37
  Bottom 0.4: JE.A 84.84,51.31 93.73,51.31 RD28.1
N$38
  Bottom 0.4: RET.A 79.5,52.58 92.46,52.58 RD29.1
N$39
  Bottom 0.4: HLT.A 74.17,53.85 RD30.1
N$40
  Bottom 0.4: ADX.A 63.25,50.55 RD31.1
N$41
  Bottom 0.4: ADY.A 59.44,50.04 60.71,51.31 RD32.1
N$42
  Bottom 0.4: ADA.A 51.82,51.31 56.9,51.31 58.17,52.58 RD33.1
N$43
  Bottom 0.4: RD34.1 54.36,52.58 46.48,52.58 ADI.A
N$44
  Bottom 0.4: ADV.A 41.02,53.85 RD35.1
N$45
  Bottom 0.4: RD36.1 28.96,50.04 SUX.A
N$46
  Bottom 0.4: RD37.1 22.61,51.44 SUY.A
N$47
  Bottom 0.4: SUA.A 20.07,52.7 RD38.1
N$48
  Bottom 0.4: SUI.A 13.34,52.58 16.26,52.58 RD39.1
N$49
  Bottom 0.4: SUV.A 8,53.85 RD40.1
N$50
  Bottom 0.4: LDX.A 211.84,17.02 RD41.1
N$51
  Bottom 0.4: RD42.1 208.03,13.21 LDY.A
N$52
  Bottom 0.4: RD43.1 202.44,16.26 LDA.A
N$53
  Bottom 0.4: LDXI.A 199.14,16.51 RD44.1
N$54
  Bottom 0.4: LDYI.A 191.77,15.75 195.33,15.75 RD45.1
N$55
  Bottom 0.4: LDAI.A 186.44,17.02 RD46.1
N$56
  Bottom 0.4: MXY.A 170.94,18.29 RD47.1
N$57
  Bottom 0.4: RD48.1 168.66,13.21 MXA.A
N$58
  Bottom 0.4: MYX.A 161.04,14.99 RD49.1
N$59
  Bottom 0.4: RD50.1 158.5,15.49 MYA.A
N$60
  Bottom 0.4: MAX.A 152.15,13.21 155.96,17.02 RD51.1
N$61
  Bottom 0.4: MAY.A 147.07,13.21 152.15,18.29 RD52.1
N$62
  Bottom 0.4: RD53.1 126.75,14.48 135.13,14.48 ANX.A
N$63
  Bottom 0.4: ANY.A 125.48,13.21 RD54.1
N$64
  Bottom 0.4: ANA.A 122.94,13.21 RD55.1
N$65
  Bottom 0.4: RD56.1 ANV.A
N$66
  Bottom 0.4: ORX.A 113.79,17.02 RD57.1
N$67
  Bottom 0.4: ORY.A 104.65,14.48 108.97,14.48 RD58.1
N$68
  Bottom 0.4: ORA.A 99.31,15.75 107.7,15.75 RD59.1
N$69
  Bottom 0.4: ORV.A 93.98,17.02 RD60.1
N$70
  Bottom 0.4: RD61.1 79.76,17.02 XOX.A
N$71
  Bottom 0.4: XOY.A 74.42,15.75 69.6,15.75 RD62.1
N$72
  Bottom 0.4: XOA.A 69.6,13.21 RD63.1
N$73
  Bottom 0.4: XOV.A 63.25,13.72 RD64.1
N$74
  Bottom 0.4: RD65.1 60.71,16.76 NOX.A
N$75
  Bottom 0.4: NOY.A 54.36,13.21 RD66.1
N$76
  Bottom 0.4: NOA.A 48.01,13.21 49.28,14.48 53.09,14.48 RD67.1
N$77
  Bottom 0.4: RD68.1 51.82,15.75 39.88,15.75 NOV.A
NOA
  Top 0.4: RD67.2 54.36,23.37 54.36,5.59 55.63,4.32 INC8.2
  Bottom 0.4: D8.9 RD67.2
NOP
  Top 0.4: RD8.2 205.49,60.2 205.49,43.69 206.76,42.42 INC0.7
  Bottom 0.4: RD8.2 D0.15
NOV
  Top 0.4: RD68.2 51.82,23.37 51.82,15.75 53.09,14.48 INC8.1
  Bottom 0.4: RD68.2 53.09,28.45 58.17,33.53 D8.7
NOX
  Top 0.4: RD65.2 59.44,23.37 59.44,6.86 60.71,5.59 INC8.4
  Bottom 0.4: RD65.2 D8.11
NOY
  Top 0.4: RD66.2 56.9,23.37 56.9,15.75 55.63,14.48 55.63,8.13 58.17,5.59 INC8.3
  Bottom 0.4: D8.10 RD66.2
ORA
  Top 0.4: INC7.2 108.97,8.13 107.7,9.4 107.7,23.37 RD59.2
  Bottom 0.4: RD59.2 D7.9
ORV
  Top 0.4: INC7.1 106.43,13.21 105.16,14.48 105.16,23.37 RD60.2
  Bottom 0.4: RD60.2 106.43,27.18 111.51,32.26 D7.7
ORX
  Top 0.4: INC7.4 114.05,14.48 115.32,15.75 115.32,23.37 RD57.2
  Bottom 0.4: RD57.2 D7.11
ORY
  Top 0.4: RD58.2 112.78,23.37 112.78,10.67 111.51,9.4 INC7.3
  Bottom 0.4: D7.10 RD58.2
OUA
  Top 0.4: INC0.1 191.52,51.31 190.25,52.58 190.25,60.2 RD14.2
  Bottom 0.4: RD14.2 D0.9
OUX
  Top 0.4: RD12.2 195.33,60.2 195.33,52.58 194.06,51.31 194.06,44.96 196.6,42.42 INC0.3
  Bottom 0.4: RD12.2 D0.11
OUY
  Top 0.4: RD13.2 192.79,60.2 192.79,42.42 194.06,41.15 INC0.2
  Bottom 0.4: D0.10 RD13.2
RET
  Top 0.4: INC2.2 93.73,51.31 95,52.58 95,60.2 RD29.2
  Bottom 0.4: D2.9 RD29.2
STA
  Top 0.4: INC1.1 135.64,42.42 134.37,43.69 134.37,60.2 RD22.2
  Bottom 0.4: RD22.2 135.64,64.01 138.18,66.55 139.45,66.55 140.72,67.82 D1.7
STX
  Top 0.4: INC1.3 140.72,51.31 139.45,52.58 139.45,60.2 RD20.2
  Bottom 0.4: D1.10 RD20.2
STY
  Top 0.4: RD21.2 136.91,60.2 136.91,52.58 138.18,51.31 INC1.2
  Bottom 0.4: RD21.2 D1.9
SUA
  Top 0.4: RD38.2 21.34,60.2 21.34,52.58 20.07,51.31 INC4.3
  Bottom 0.4: RD38.2 D4.13
SUI
  Top 0.4: RD39.2 18.8,60.2 18.8,46.23 17.53,44.96 INC4.2
  Bottom 0.4: D4.12 RD39.2
SUV
  Top 0.4: INC4.1 14.99,51.31 16.26,52.58 16.26,60.2 RD40.2
  Bottom 0.4: RD40.2 D4.11
SUX
  Top 0.4: INC4.5 25.15,51.31 26.42,52.58 26.42,60.2 RD36.2
  Bottom 0.4: RD36.2 D4.15
SUY
  Top 0.4: RD37.2 23.88,60.2 23.88,52.58 22.61,51.31 INC4.4
  Bottom 0.4: D4.14 RD37.2
VCC  (via drill 0.35)
  Top 0.4: D0.16 211.84,66.55 | 211.84,66.55 C3.+ | 211.84,66.55 v197.87,66.55 196.6,67.82 D0.6 | D1.6 143.26,69.09 145.8,66.55 | 145.8,66.55 146.3,66.04 155.19,66.04 155.96,65.28 D1.16 | C5.+ 145.8,66.55 | D3.6 53.09,69.6 v55.88,66.8 56.77,65.91 65.15,65.91 65.79,65.28 D3.16 74.68,64.01 C6.+ v101.35,66.55 | D4.6 14.99,70.36 19.3,66.04 26.92,66.04 | 26.92,66.04 27.69,65.28 D4.16 | C7.+ 32.26,66.04 26.92,66.04 | SELECTOR.16 173.74,100.84 166.12,100.84 164.85,102.11 164.85,109.73 SELECTOR.6 | D5.6 196.6,33.53 197.1,33.02 | 197.1,33.02 207.26,33.02 209.3,30.99 D5.16 211.84,29.72 C8.+ 215.65,30.99 v215.65,34.8 | 155.96,32.26 157.23,30.99 167.39,30.99 168.66,29.72 D6.16 171.2,30.99 C9.+ 195.07,30.99 197.1,33.02 | 155.96,32.26 D6.6 | C10.+ 135.13,29.72 137.67,32.26 155.96,32.26 | v117.22,29.08 116.59,29.72 C11.+
  Bottom 0.4: v197.87,66.55 C4.+ 158.5,66.55 D1.16 | C5.+ 114.05,66.55 D2.16 109.35,66.17 101.73,66.17 v101.35,66.55 98.81,69.09 D2.6 | v55.88,66.8 55.63,66.55 C7.+ | SELECTOR.16 177.55,104.65 C2.+ 197.87,117.35 206.76,117.35 | C1.+ 208.03,117.35 206.76,117.35 | IR.1 IR.20 | IR.1 215.65,91.95 216.28,92.58 216.28,121.03 213.61,123.7 208.03,123.7 206.76,122.43 206.76,117.35 | IR.1 PS.2 | C3.+ 215.65,65.28 | 215.65,65.28 216.92,64.01 216.92,36.07 v215.65,34.8 | D7.6 114.05,32.26 v117.22,29.08 126.11,29.08 126.75,28.45 D7.16 129.29,29.72 C10.+ | D8.6 60.71,30.99 61.98,29.72 72.14,29.72 73.41,28.45 D8.16 75.95,29.72 C11.+ | IR.1 215.65,90.68 215.65,65.28
XOA
  Top 0.4: RD63.2 64.52,23.37 64.52,15.75 65.79,14.48 INC8.6
  Bottom 0.4: RD63.2 D8.13
XOV
  Top 0.4: RD64.2 61.98,23.37 61.98,9.4 63.25,8.13 INC8.5
  Bottom 0.4: D8.12 RD64.2
XOX
  Top 0.4: RD61.2 69.6,23.37 69.6,15.75 68.33,14.48 68.33,8.13 70.87,5.59 INC8.8
  Bottom 0.4: RD61.2 D8.15
XOY
  Top 0.4: INC8.7 68.33,4.32 67.06,5.59 67.06,23.37 RD62.2
  Bottom 0.4: D8.14 RD62.2